# EAGLE schematic electrotactile_extension (EAGLE 9.4.0)
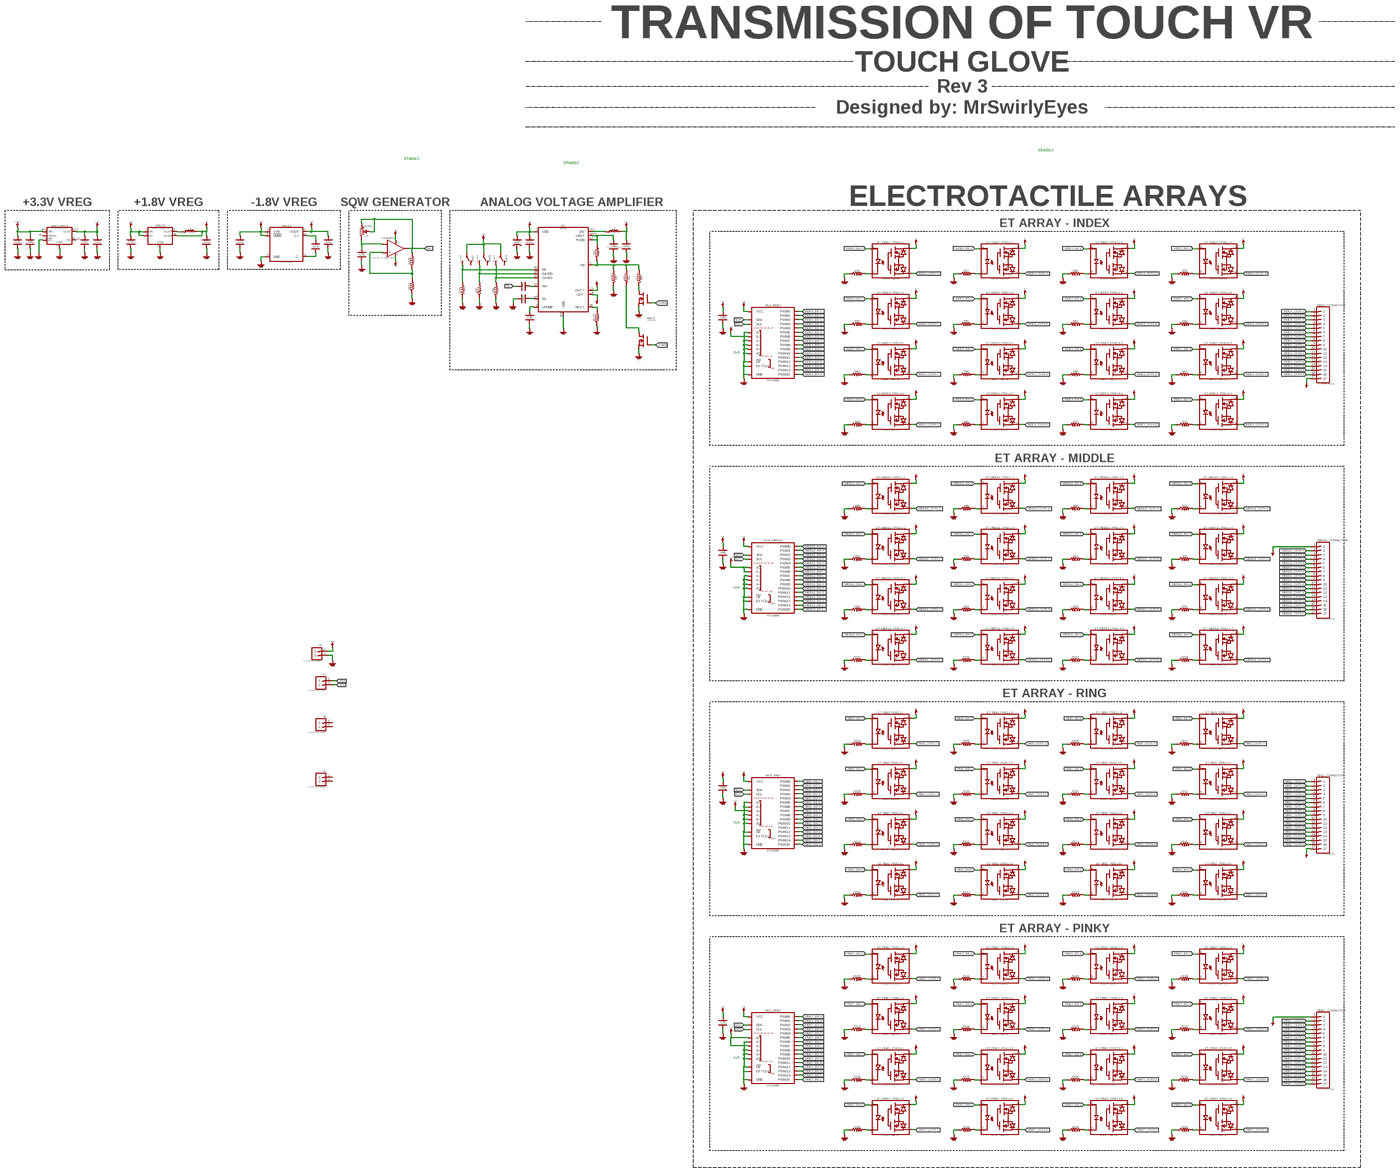
[diagram p0: schematic, sheet 1, overview]
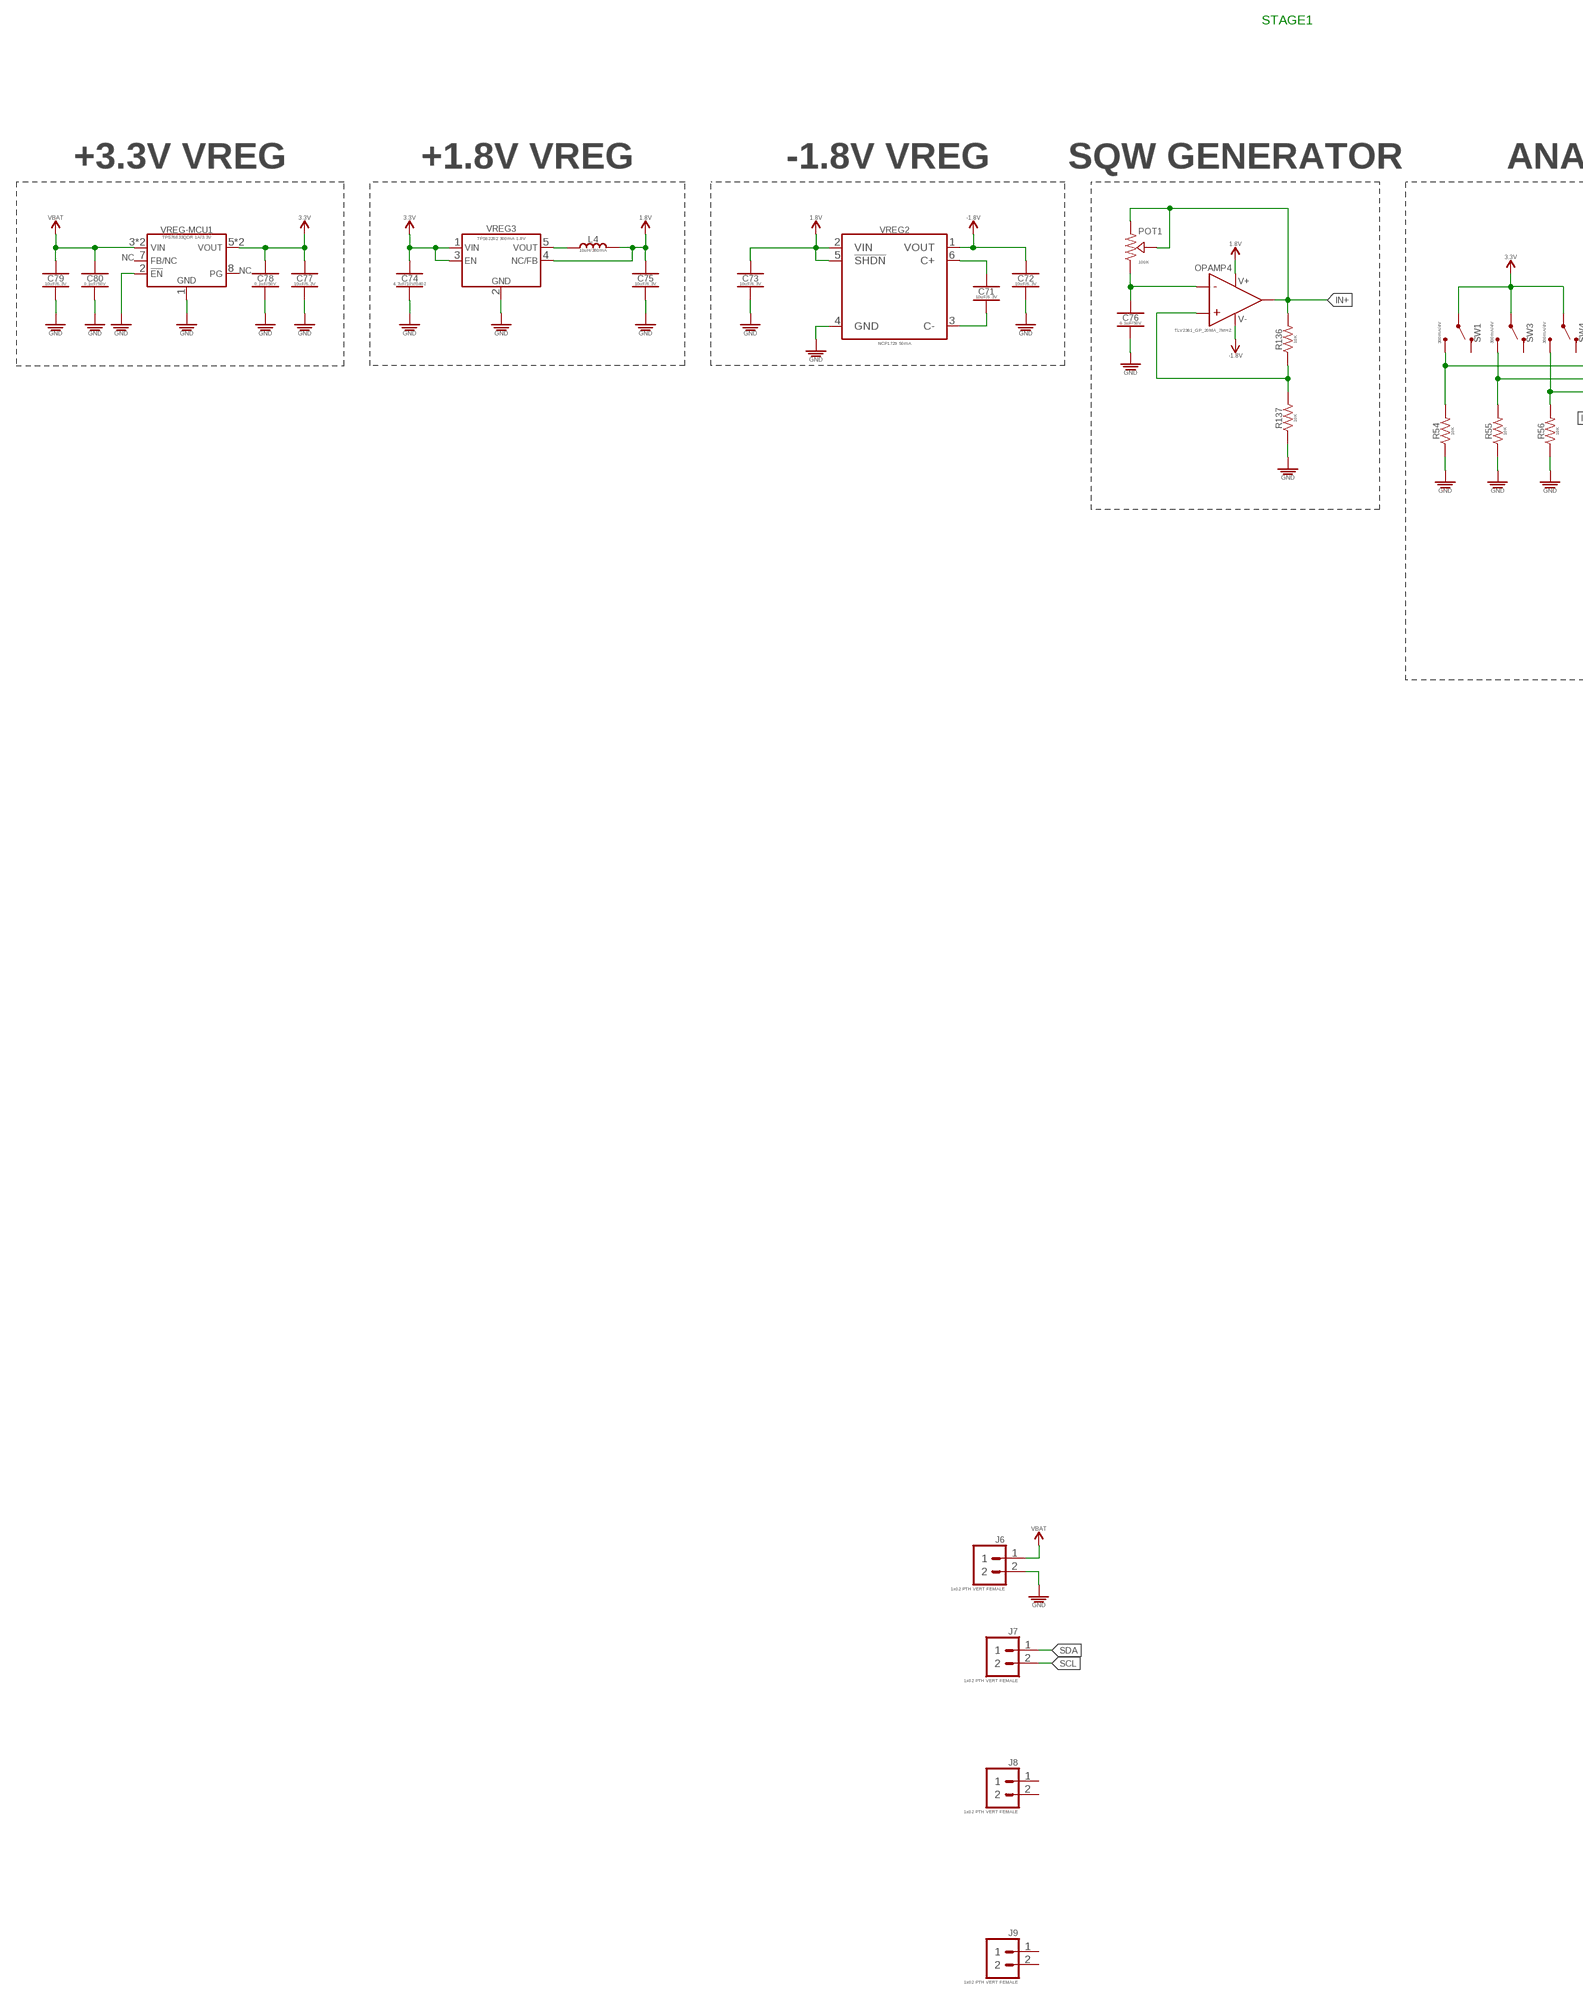
[diagram p1: schematic, sheet 1, part 1 of 5]
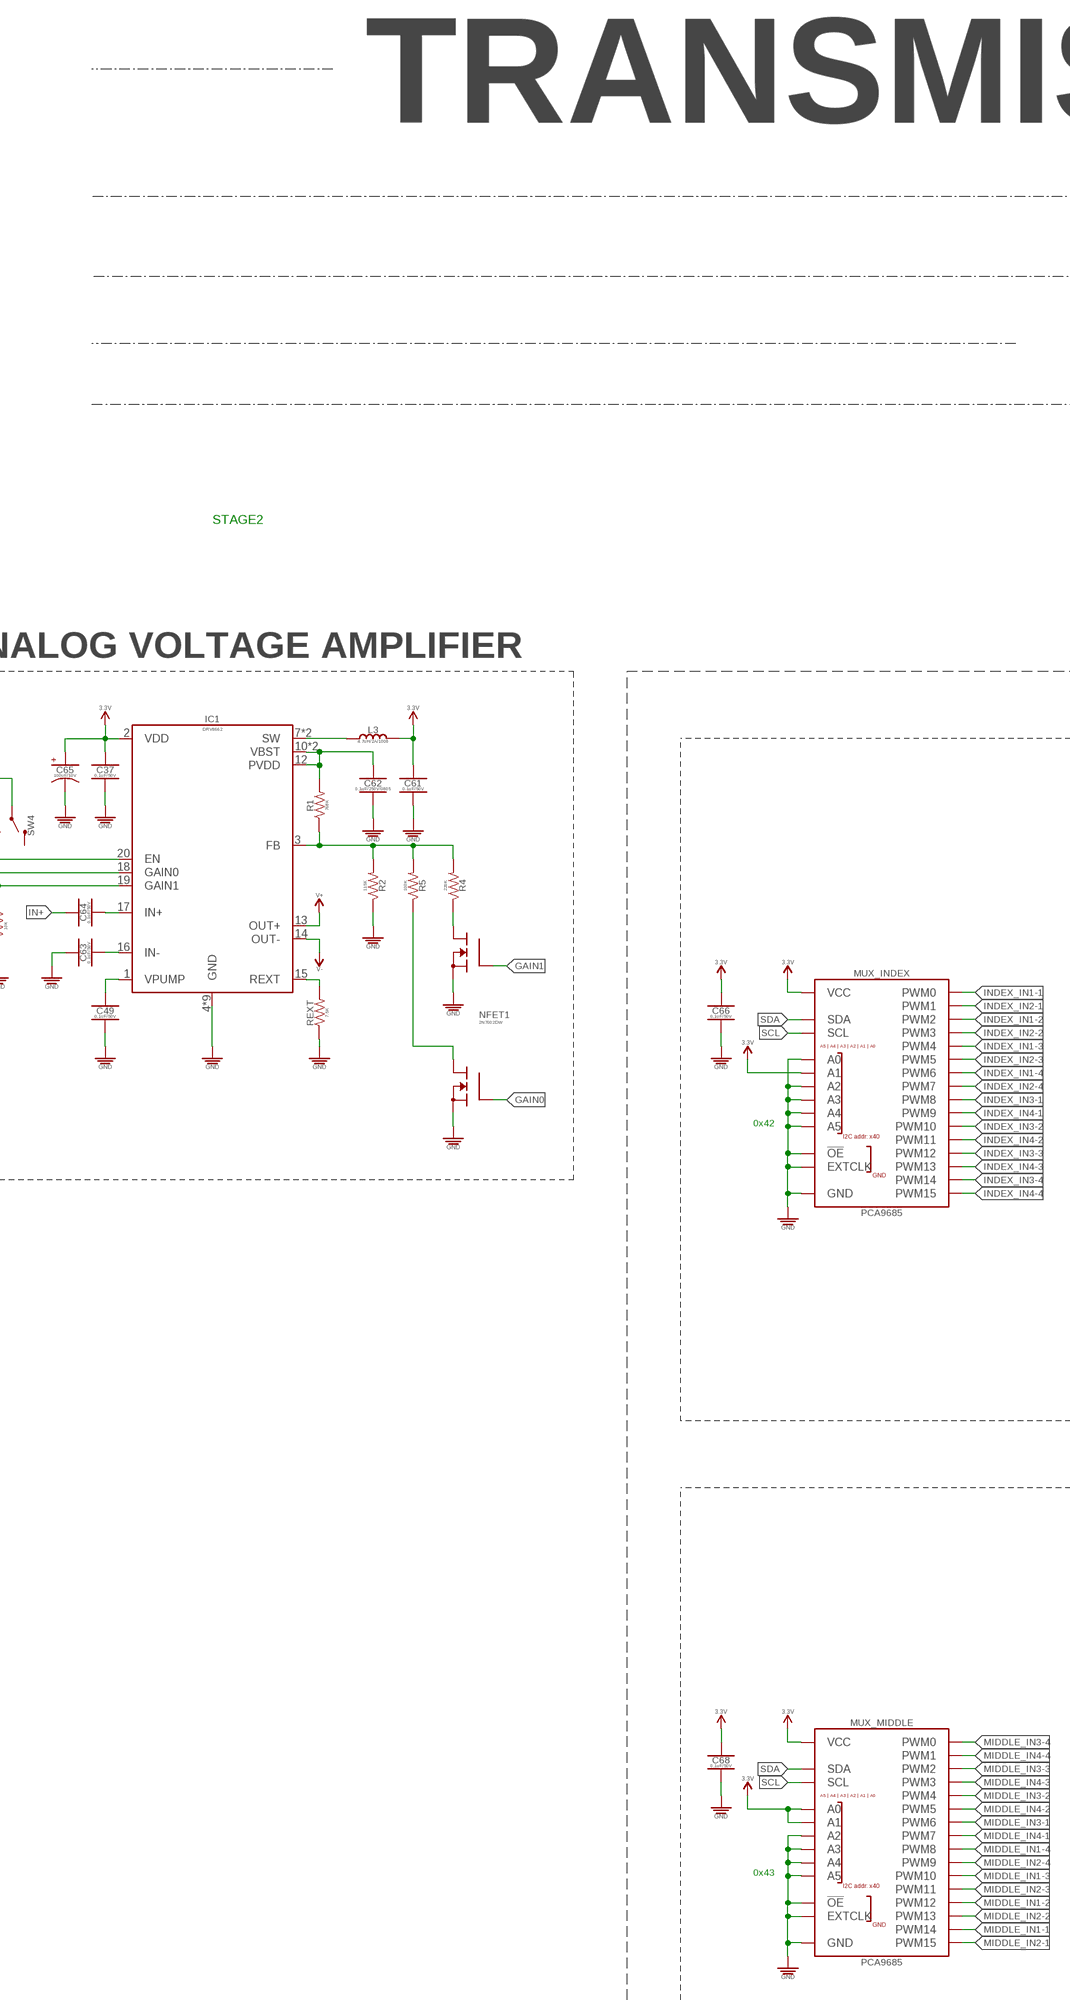
[diagram p2: schematic, sheet 1, part 2 of 5]
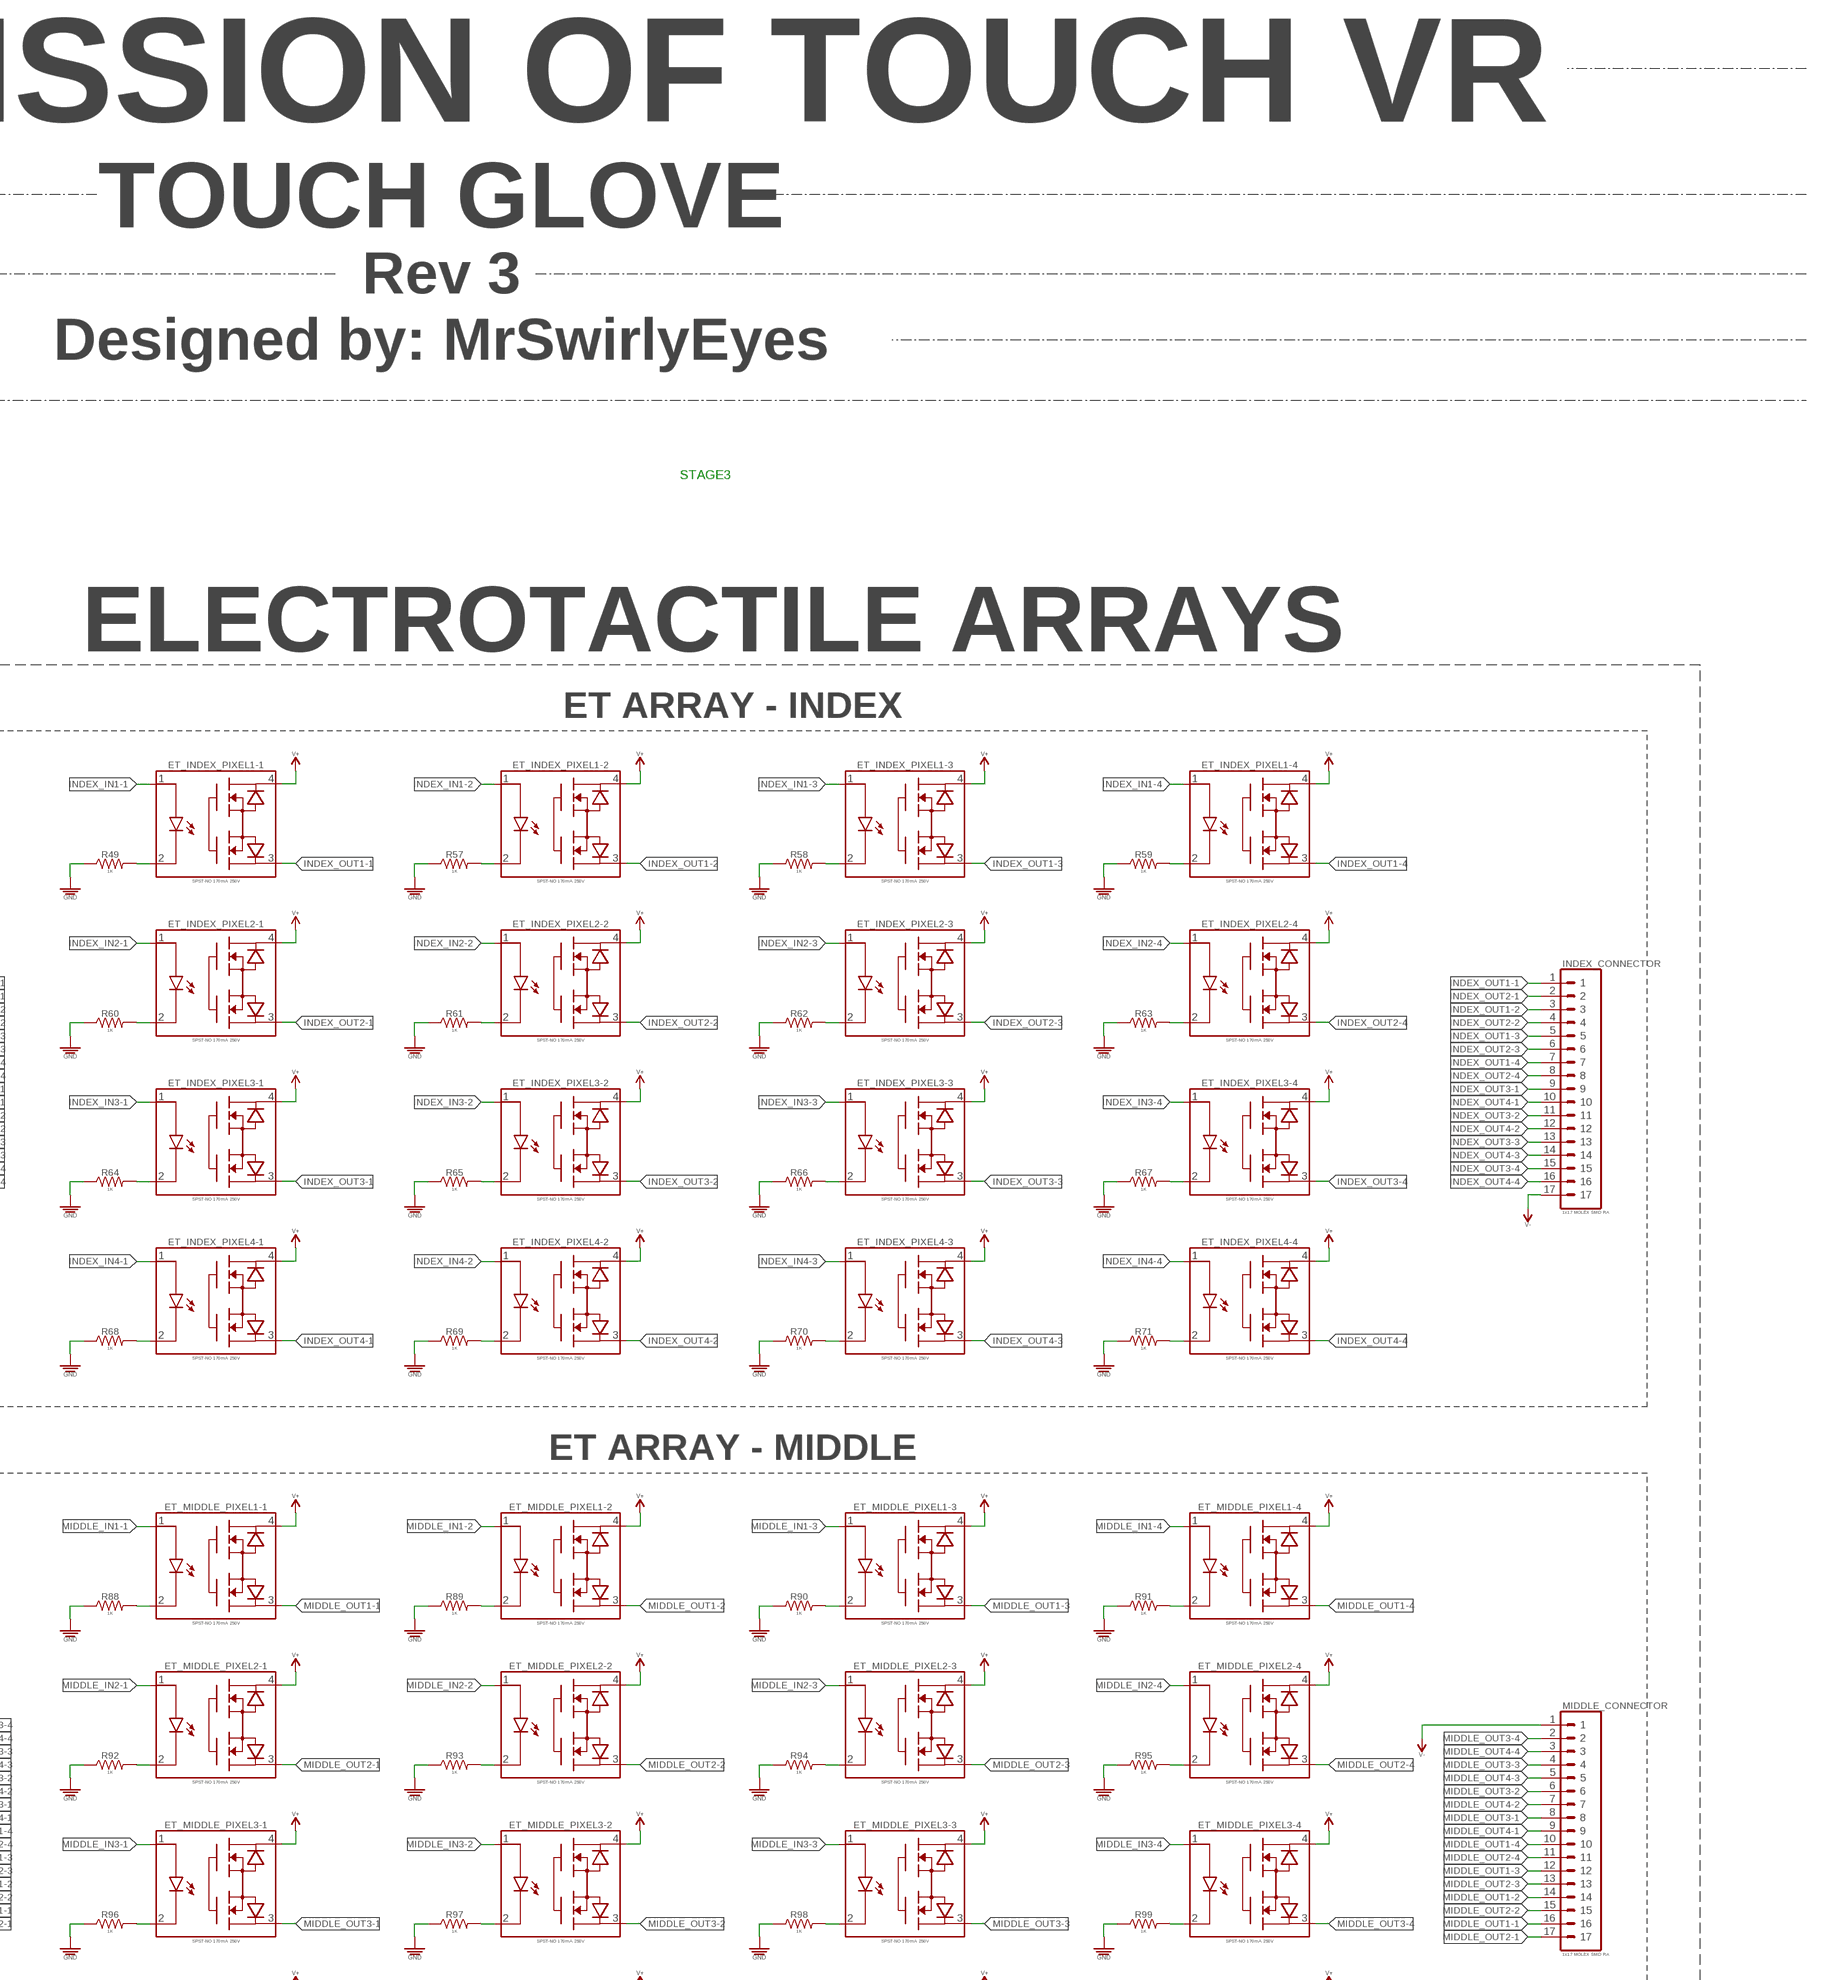
[diagram p3: schematic, sheet 1, part 3 of 5]
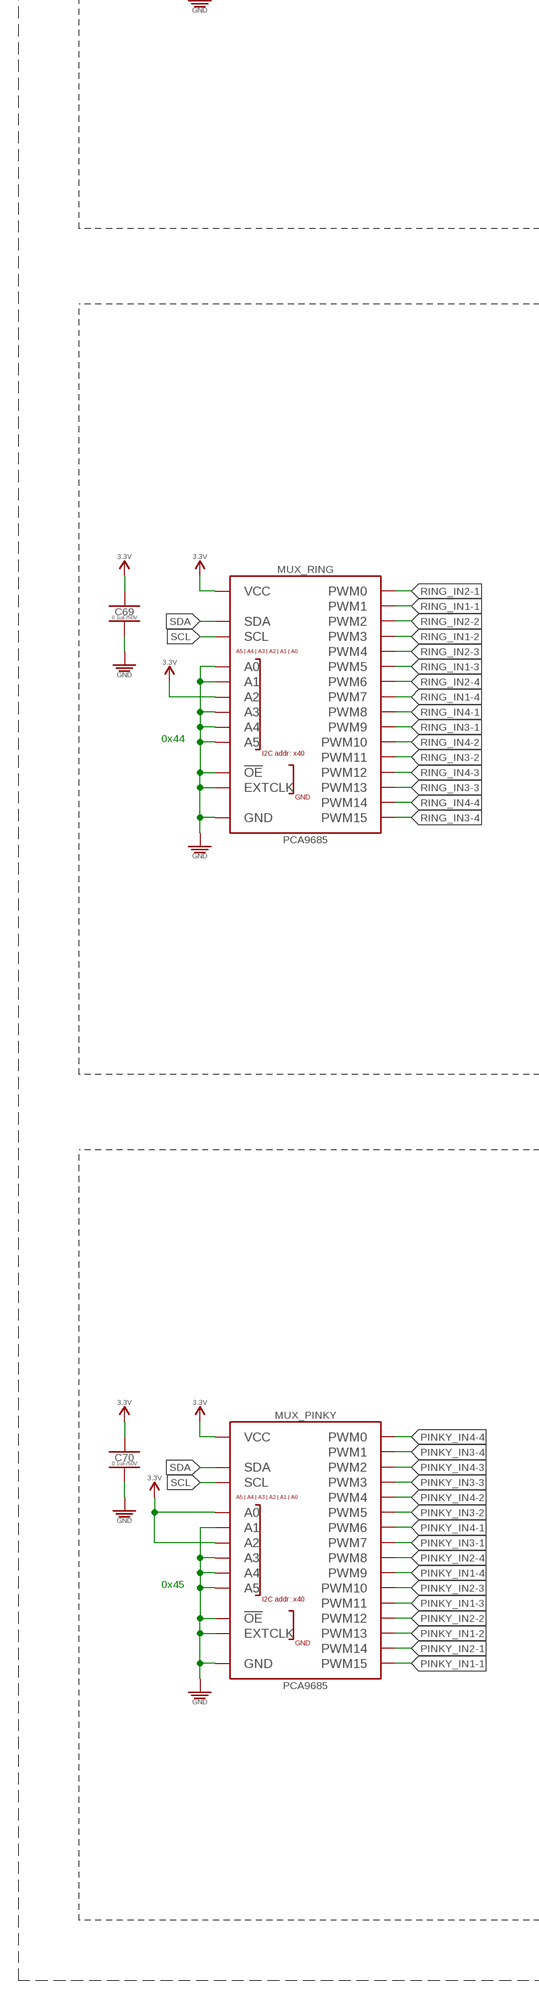
[diagram p4: schematic, sheet 1, part 4 of 5]
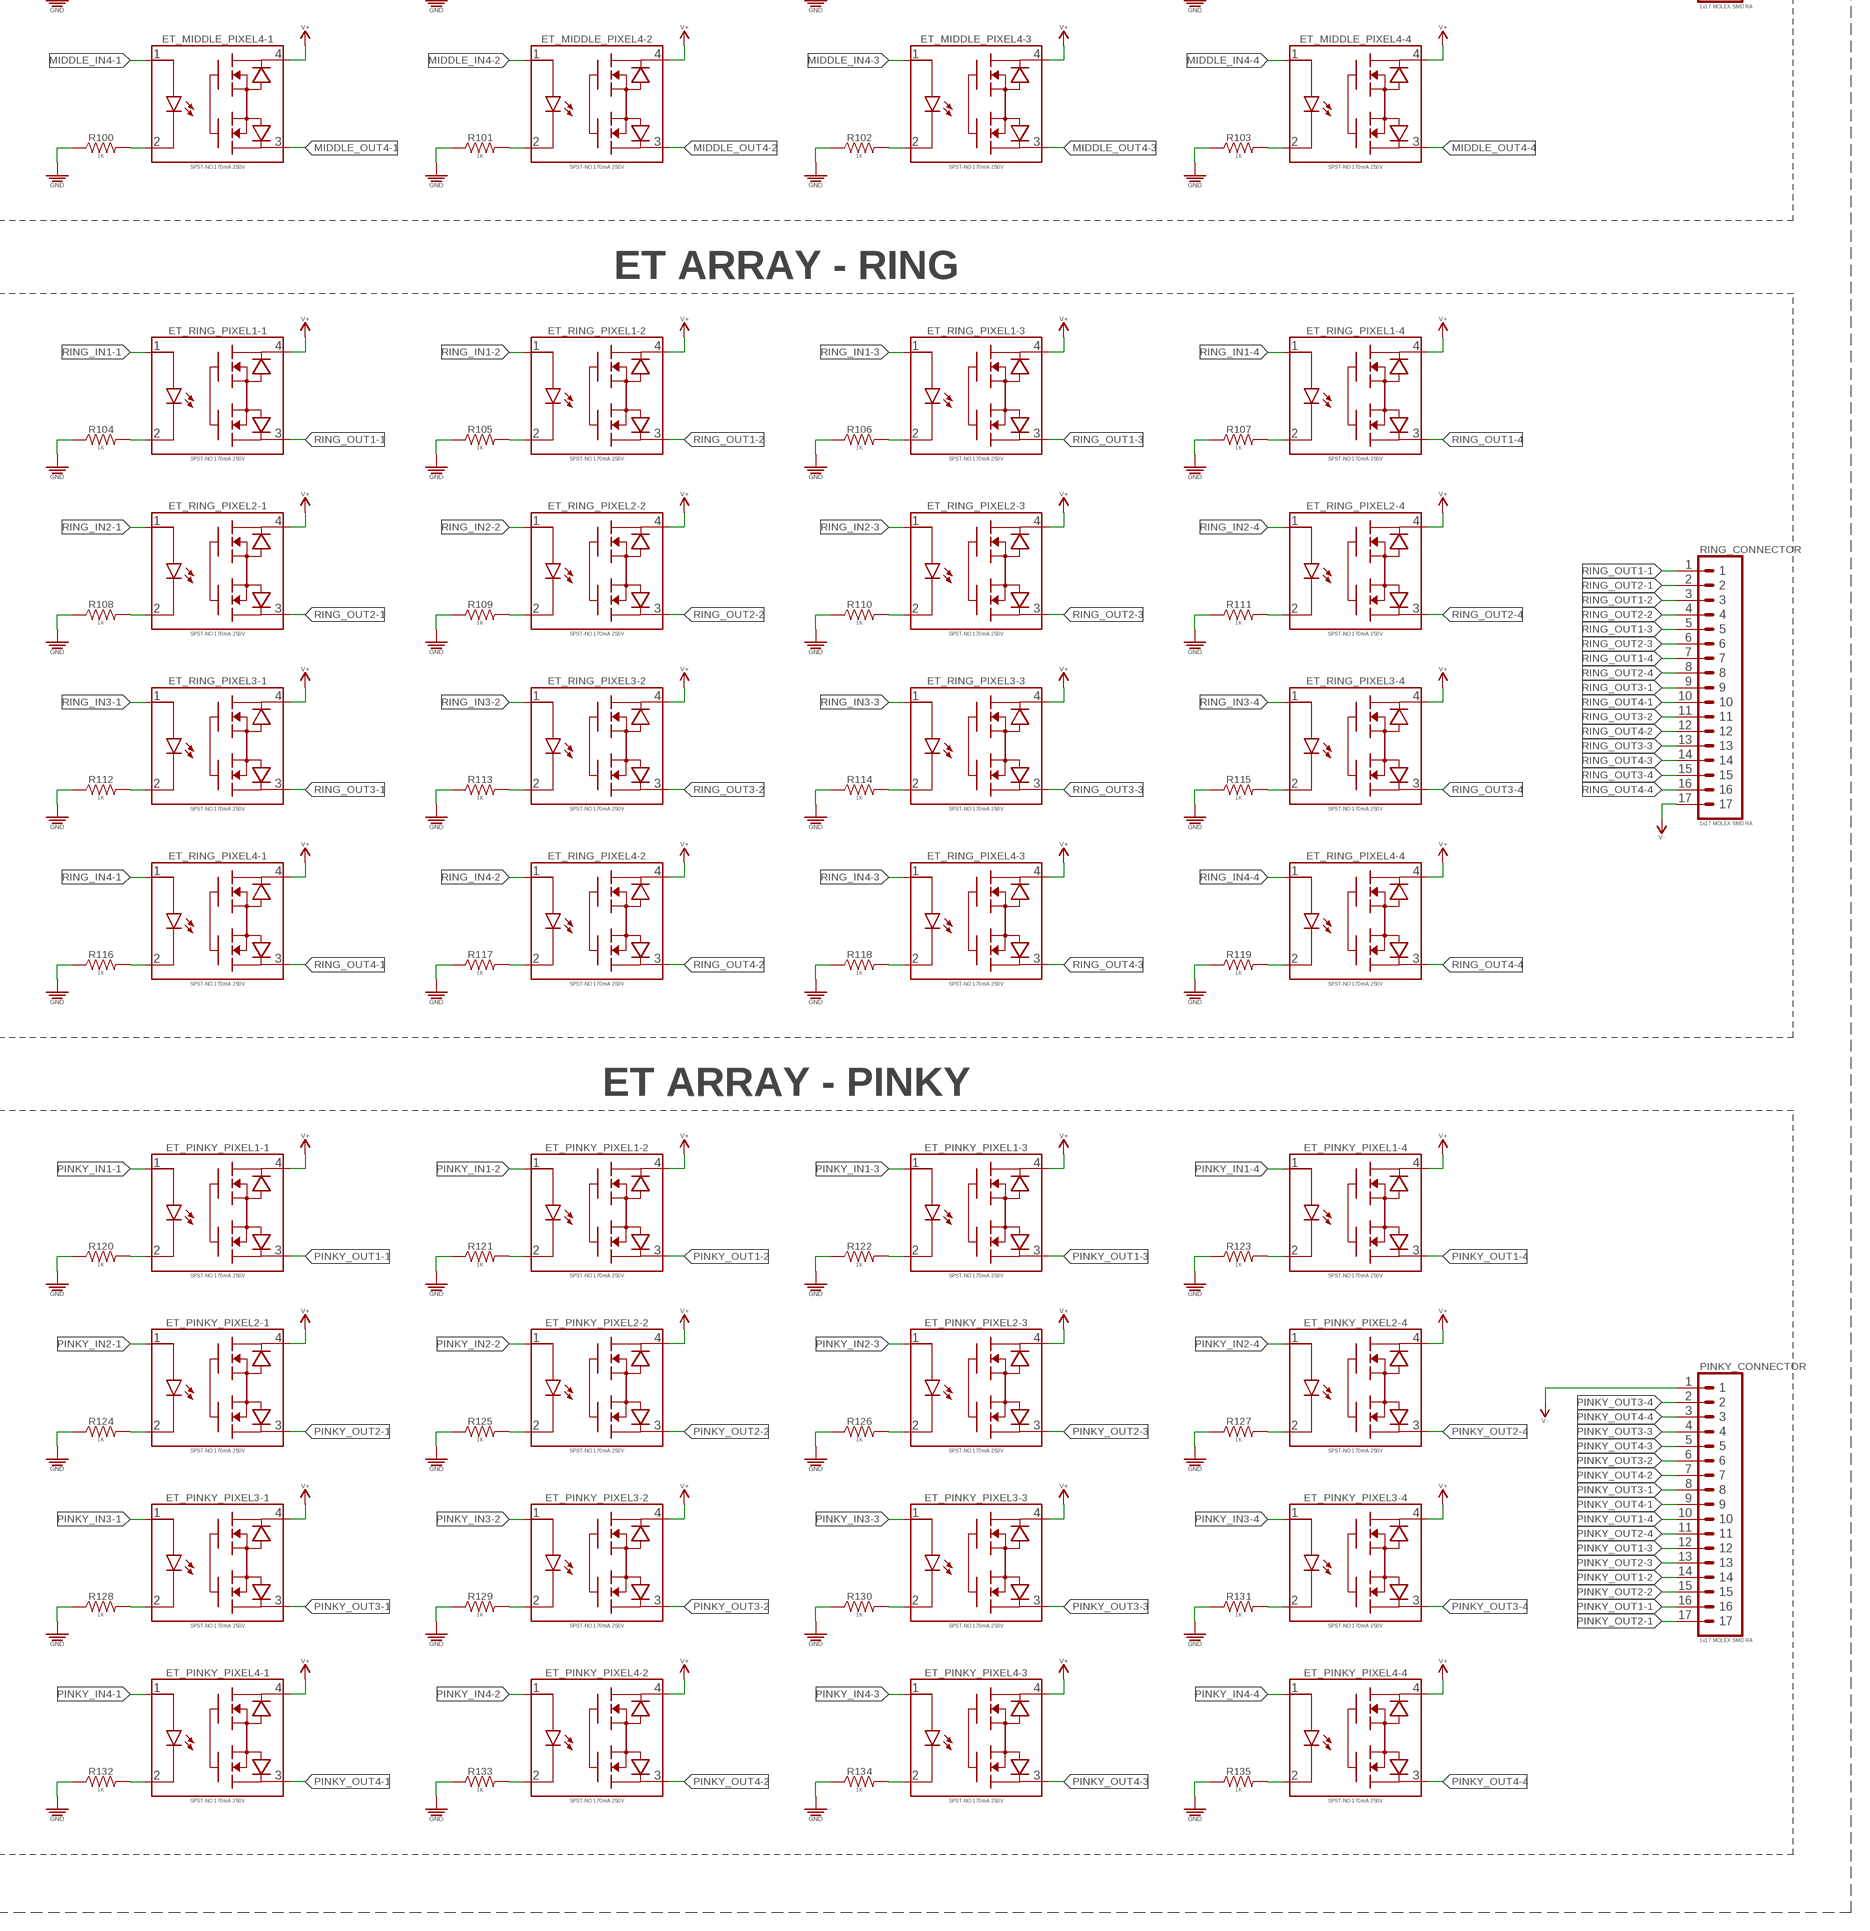
[diagram p5: schematic, sheet 1, part 5 of 5]

## Parts
C37  0.1uF/50V  0.1UF_SMD-0402_50V-10%  [CAPC1005X55_SMD-0402]
C49  0.1uF/50V  0.1UF_SMD-0402_50V-10%  [CAPC1005X55_SMD-0402]
C61  0.1uF/50V  0.1UF_SMD-0603_50V-20%  [CAPC1608X95]
C62  0.1uF/250V/0805  0.1UF_SMD-0805_250V-10%  [CAPC2012X95_SMD-0805]
C63  0.1uF/50V  0.1UF_SMD-0402_50V-10%  [CAPC1005X55_SMD-0402]
C64  0.1uF/50V  0.1UF_SMD-0402_50V-10%  [CAPC1005X55_SMD-0402]
C65  100uF/10V  100UF-POLARIZED_TANT_SMD-1206_10V-20%  [CAPCP3216X160]
C66  0.1uF/50V  0.1UF_SMD-0402_50V-10%  [CAPC1005X55_SMD-0402]
C68  0.1uF/50V  0.1UF_SMD-0402_50V-10%  [CAPC1005X55_SMD-0402]
C69  0.1uF/50V  0.1UF_SMD-0402_50V-10%  [CAPC1005X55_SMD-0402]
C70  0.1uF/50V  0.1UF_SMD-0402_50V-10%  [CAPC1005X55_SMD-0402]
C71  10uF/6.3V  10UF_CER_SMD-0402_6.3V-20%  [CAPC1005X55_SMD-0402]
C72  10uF/6.3V  10UF_CER_SMD-0402_6.3V-20%  [CAPC1005X55_SMD-0402]
C73  10uF/6.3V  10UF_CER_SMD-0402_6.3V-20%  [CAPC1005X55_SMD-0402]
C74  4.7uF/10V/0402  4.7UF_CER_SMD-0402_10V-20%  [CAPC1005X55_SMD-0402]
C75  10uF/6.3V  10UF_CER_SMD-0402_6.3V-20%  [CAPC1005X55_SMD-0402]
C76  0.1uF/50V  0.1UF_SMD-0402_50V-10%  [CAPC1005X55_SMD-0402]
C77  10uF/6.3V  10UF_CER_SMD-0402_6.3V-20%  [CAPC1005X55_SMD-0402]
C78  0.1uF/50V  0.1UF_SMD-0402_50V-10%  [CAPC1005X55_SMD-0402]
C79  10uF/6.3V  10UF_CER_SMD-0402_6.3V-20%  [CAPC1005X55_SMD-0402]
C80  0.1uF/50V  0.1UF_SMD-0402_50V-10%  [CAPC1005X55_SMD-0402]
ET_INDEX_PIXEL1-1  SPST-NO 170mA 250V  RELAY_SOLID-STATE_SSR_170MA_250V_SPST-NO  [SOP254P609X203-4]
ET_INDEX_PIXEL1-2  SPST-NO 170mA 250V  RELAY_SOLID-STATE_SSR_170MA_250V_SPST-NO  [SOP254P609X203-4]
ET_INDEX_PIXEL1-3  SPST-NO 170mA 250V  RELAY_SOLID-STATE_SSR_170MA_250V_SPST-NO  [SOP254P609X203-4]
ET_INDEX_PIXEL1-4  SPST-NO 170mA 250V  RELAY_SOLID-STATE_SSR_170MA_250V_SPST-NO  [SOP254P609X203-4]
ET_INDEX_PIXEL2-1  SPST-NO 170mA 250V  RELAY_SOLID-STATE_SSR_170MA_250V_SPST-NO  [SOP254P609X203-4]
ET_INDEX_PIXEL2-2  SPST-NO 170mA 250V  RELAY_SOLID-STATE_SSR_170MA_250V_SPST-NO  [SOP254P609X203-4]
ET_INDEX_PIXEL2-3  SPST-NO 170mA 250V  RELAY_SOLID-STATE_SSR_170MA_250V_SPST-NO  [SOP254P609X203-4]
ET_INDEX_PIXEL2-4  SPST-NO 170mA 250V  RELAY_SOLID-STATE_SSR_170MA_250V_SPST-NO  [SOP254P609X203-4]
ET_INDEX_PIXEL3-1  SPST-NO 170mA 250V  RELAY_SOLID-STATE_SSR_170MA_250V_SPST-NO  [SOP254P609X203-4]
ET_INDEX_PIXEL3-2  SPST-NO 170mA 250V  RELAY_SOLID-STATE_SSR_170MA_250V_SPST-NO  [SOP254P609X203-4]
ET_INDEX_PIXEL3-3  SPST-NO 170mA 250V  RELAY_SOLID-STATE_SSR_170MA_250V_SPST-NO  [SOP254P609X203-4]
ET_INDEX_PIXEL3-4  SPST-NO 170mA 250V  RELAY_SOLID-STATE_SSR_170MA_250V_SPST-NO  [SOP254P609X203-4]
ET_INDEX_PIXEL4-1  SPST-NO 170mA 250V  RELAY_SOLID-STATE_SSR_170MA_250V_SPST-NO  [SOP254P609X203-4]
ET_INDEX_PIXEL4-2  SPST-NO 170mA 250V  RELAY_SOLID-STATE_SSR_170MA_250V_SPST-NO  [SOP254P609X203-4]
ET_INDEX_PIXEL4-3  SPST-NO 170mA 250V  RELAY_SOLID-STATE_SSR_170MA_250V_SPST-NO  [SOP254P609X203-4]
ET_INDEX_PIXEL4-4  SPST-NO 170mA 250V  RELAY_SOLID-STATE_SSR_170MA_250V_SPST-NO  [SOP254P609X203-4]
ET_MIDDLE_PIXEL1-1  SPST-NO 170mA 250V  RELAY_SOLID-STATE_SSR_170MA_250V_SPST-NO  [SOP254P609X203-4]
ET_MIDDLE_PIXEL1-2  SPST-NO 170mA 250V  RELAY_SOLID-STATE_SSR_170MA_250V_SPST-NO  [SOP254P609X203-4]
ET_MIDDLE_PIXEL1-3  SPST-NO 170mA 250V  RELAY_SOLID-STATE_SSR_170MA_250V_SPST-NO  [SOP254P609X203-4]
ET_MIDDLE_PIXEL1-4  SPST-NO 170mA 250V  RELAY_SOLID-STATE_SSR_170MA_250V_SPST-NO  [SOP254P609X203-4]
ET_MIDDLE_PIXEL2-1  SPST-NO 170mA 250V  RELAY_SOLID-STATE_SSR_170MA_250V_SPST-NO  [SOP254P609X203-4]
ET_MIDDLE_PIXEL2-2  SPST-NO 170mA 250V  RELAY_SOLID-STATE_SSR_170MA_250V_SPST-NO  [SOP254P609X203-4]
ET_MIDDLE_PIXEL2-3  SPST-NO 170mA 250V  RELAY_SOLID-STATE_SSR_170MA_250V_SPST-NO  [SOP254P609X203-4]
ET_MIDDLE_PIXEL2-4  SPST-NO 170mA 250V  RELAY_SOLID-STATE_SSR_170MA_250V_SPST-NO  [SOP254P609X203-4]
ET_MIDDLE_PIXEL3-1  SPST-NO 170mA 250V  RELAY_SOLID-STATE_SSR_170MA_250V_SPST-NO  [SOP254P609X203-4]
ET_MIDDLE_PIXEL3-2  SPST-NO 170mA 250V  RELAY_SOLID-STATE_SSR_170MA_250V_SPST-NO  [SOP254P609X203-4]
ET_MIDDLE_PIXEL3-3  SPST-NO 170mA 250V  RELAY_SOLID-STATE_SSR_170MA_250V_SPST-NO  [SOP254P609X203-4]
ET_MIDDLE_PIXEL3-4  SPST-NO 170mA 250V  RELAY_SOLID-STATE_SSR_170MA_250V_SPST-NO  [SOP254P609X203-4]
ET_MIDDLE_PIXEL4-1  SPST-NO 170mA 250V  RELAY_SOLID-STATE_SSR_170MA_250V_SPST-NO  [SOP254P609X203-4]
ET_MIDDLE_PIXEL4-2  SPST-NO 170mA 250V  RELAY_SOLID-STATE_SSR_170MA_250V_SPST-NO  [SOP254P609X203-4]
ET_MIDDLE_PIXEL4-3  SPST-NO 170mA 250V  RELAY_SOLID-STATE_SSR_170MA_250V_SPST-NO  [SOP254P609X203-4]
ET_MIDDLE_PIXEL4-4  SPST-NO 170mA 250V  RELAY_SOLID-STATE_SSR_170MA_250V_SPST-NO  [SOP254P609X203-4]
ET_PINKY_PIXEL1-1  SPST-NO 170mA 250V  RELAY_SOLID-STATE_SSR_170MA_250V_SPST-NO  [SOP254P609X203-4]
ET_PINKY_PIXEL1-2  SPST-NO 170mA 250V  RELAY_SOLID-STATE_SSR_170MA_250V_SPST-NO  [SOP254P609X203-4]
ET_PINKY_PIXEL1-3  SPST-NO 170mA 250V  RELAY_SOLID-STATE_SSR_170MA_250V_SPST-NO  [SOP254P609X203-4]
ET_PINKY_PIXEL1-4  SPST-NO 170mA 250V  RELAY_SOLID-STATE_SSR_170MA_250V_SPST-NO  [SOP254P609X203-4]
ET_PINKY_PIXEL2-1  SPST-NO 170mA 250V  RELAY_SOLID-STATE_SSR_170MA_250V_SPST-NO  [SOP254P609X203-4]
ET_PINKY_PIXEL2-2  SPST-NO 170mA 250V  RELAY_SOLID-STATE_SSR_170MA_250V_SPST-NO  [SOP254P609X203-4]
ET_PINKY_PIXEL2-3  SPST-NO 170mA 250V  RELAY_SOLID-STATE_SSR_170MA_250V_SPST-NO  [SOP254P609X203-4]
ET_PINKY_PIXEL2-4  SPST-NO 170mA 250V  RELAY_SOLID-STATE_SSR_170MA_250V_SPST-NO  [SOP254P609X203-4]
ET_PINKY_PIXEL3-1  SPST-NO 170mA 250V  RELAY_SOLID-STATE_SSR_170MA_250V_SPST-NO  [SOP254P609X203-4]
ET_PINKY_PIXEL3-2  SPST-NO 170mA 250V  RELAY_SOLID-STATE_SSR_170MA_250V_SPST-NO  [SOP254P609X203-4]
ET_PINKY_PIXEL3-3  SPST-NO 170mA 250V  RELAY_SOLID-STATE_SSR_170MA_250V_SPST-NO  [SOP254P609X203-4]
ET_PINKY_PIXEL3-4  SPST-NO 170mA 250V  RELAY_SOLID-STATE_SSR_170MA_250V_SPST-NO  [SOP254P609X203-4]
ET_PINKY_PIXEL4-1  SPST-NO 170mA 250V  RELAY_SOLID-STATE_SSR_170MA_250V_SPST-NO  [SOP254P609X203-4]
ET_PINKY_PIXEL4-2  SPST-NO 170mA 250V  RELAY_SOLID-STATE_SSR_170MA_250V_SPST-NO  [SOP254P609X203-4]
ET_PINKY_PIXEL4-3  SPST-NO 170mA 250V  RELAY_SOLID-STATE_SSR_170MA_250V_SPST-NO  [SOP254P609X203-4]
ET_PINKY_PIXEL4-4  SPST-NO 170mA 250V  RELAY_SOLID-STATE_SSR_170MA_250V_SPST-NO  [SOP254P609X203-4]
ET_RING_PIXEL1-1  SPST-NO 170mA 250V  RELAY_SOLID-STATE_SSR_170MA_250V_SPST-NO  [SOP254P609X203-4]
ET_RING_PIXEL1-2  SPST-NO 170mA 250V  RELAY_SOLID-STATE_SSR_170MA_250V_SPST-NO  [SOP254P609X203-4]
ET_RING_PIXEL1-3  SPST-NO 170mA 250V  RELAY_SOLID-STATE_SSR_170MA_250V_SPST-NO  [SOP254P609X203-4]
ET_RING_PIXEL1-4  SPST-NO 170mA 250V  RELAY_SOLID-STATE_SSR_170MA_250V_SPST-NO  [SOP254P609X203-4]
ET_RING_PIXEL2-1  SPST-NO 170mA 250V  RELAY_SOLID-STATE_SSR_170MA_250V_SPST-NO  [SOP254P609X203-4]
ET_RING_PIXEL2-2  SPST-NO 170mA 250V  RELAY_SOLID-STATE_SSR_170MA_250V_SPST-NO  [SOP254P609X203-4]
ET_RING_PIXEL2-3  SPST-NO 170mA 250V  RELAY_SOLID-STATE_SSR_170MA_250V_SPST-NO  [SOP254P609X203-4]
ET_RING_PIXEL2-4  SPST-NO 170mA 250V  RELAY_SOLID-STATE_SSR_170MA_250V_SPST-NO  [SOP254P609X203-4]
ET_RING_PIXEL3-1  SPST-NO 170mA 250V  RELAY_SOLID-STATE_SSR_170MA_250V_SPST-NO  [SOP254P609X203-4]
ET_RING_PIXEL3-2  SPST-NO 170mA 250V  RELAY_SOLID-STATE_SSR_170MA_250V_SPST-NO  [SOP254P609X203-4]
ET_RING_PIXEL3-3  SPST-NO 170mA 250V  RELAY_SOLID-STATE_SSR_170MA_250V_SPST-NO  [SOP254P609X203-4]
ET_RING_PIXEL3-4  SPST-NO 170mA 250V  RELAY_SOLID-STATE_SSR_170MA_250V_SPST-NO  [SOP254P609X203-4]
ET_RING_PIXEL4-1  SPST-NO 170mA 250V  RELAY_SOLID-STATE_SSR_170MA_250V_SPST-NO  [SOP254P609X203-4]
ET_RING_PIXEL4-2  SPST-NO 170mA 250V  RELAY_SOLID-STATE_SSR_170MA_250V_SPST-NO  [SOP254P609X203-4]
ET_RING_PIXEL4-3  SPST-NO 170mA 250V  RELAY_SOLID-STATE_SSR_170MA_250V_SPST-NO  [SOP254P609X203-4]
ET_RING_PIXEL4-4  SPST-NO 170mA 250V  RELAY_SOLID-STATE_SSR_170MA_250V_SPST-NO  [SOP254P609X203-4]
IC1  DRV8662  DRV8662_PIEZO_HAPTICS_DRIVER_QFN-20-EP  [QFN50P400X400X100-21T270]
INDEX_CONNECTOR  1x17 MOLEX SMD RA  1X17_SMD_MOLEX  [1X17_MOLEX_0532611771_RA_SMD]
J6  1x02 PTH VERT FEMALE  1X02_PTH_VERT_FEMALE_2.54MM  [HDRVR2W64P254_1X2_558X254X850B]
J7  1x02 PTH VERT FEMALE  1X02_PTH_VERT_FEMALE_2.54MM  [HDRVR2W64P254_1X2_558X254X850B]
J8  1x02 PTH VERT FEMALE  1X02_PTH_VERT_FEMALE_2.54MM  [HDRVR2W64P254_1X2_558X254X850B]
J9  1x02 PTH VERT FEMALE  1X02_PTH_VERT_FEMALE_2.54MM  [HDRVR2W64P254_1X2_558X254X850B]
L3  4.7uH/2A/1008  4.7UH_SMD-1008_2A-0.200OHM-20%  [INDC2520X100]
L4  10uH/380mA  10UH_SMD-0603_0.38A-0.468OHM-10%  [INDC1608X60-0603]
MIDDLE_CONNECTOR  1x17 MOLEX SMD RA  1X17_SMD_MOLEX  [1X17_MOLEX_0532611771_RA_SMD]
MUX_INDEX  PCA9685  PCA9685_16-CH_12-BIT_PWM-DRIVER_TSSOP-28_PWM-DRIVER_16CH  [SOP65P650X110-28]
MUX_MIDDLE  PCA9685  PCA9685_16-CH_12-BIT_PWM-DRIVER_TSSOP-28_PWM-DRIVER_16CH  [SOP65P650X110-28]
MUX_PINKY  PCA9685  PCA9685_16-CH_12-BIT_PWM-DRIVER_TSSOP-28_PWM-DRIVER_16CH  [SOP65P650X110-28]
MUX_RING  PCA9685  PCA9685_16-CH_12-BIT_PWM-DRIVER_TSSOP-28_PWM-DRIVER_16CH  [SOP65P650X110-28]
NFET1  2N7002DW  MOSFET_N-CHANNEL_2-ARRAY_2N7002DW_115MA-60V  [SOT65P230X110-6]
OPAMP4  TLV2361_GP_20MA_7MHZ  [SOT95P280X145-5]
PINKY_CONNECTOR  1x17 MOLEX SMD RA  1X17_SMD_MOLEX  [1X17_MOLEX_0532611771_RA_SMD]
POT1  100K  POTENTIOMETER_ST4ETB104_100K-1/4W-20%  [POTENTIOMETER_SQ-L5-W4.5-H2.3]
R1  768K  768KΩ_SMD-0402_1/16W-1%  [RESC1005X35_SMD-0402]
R2  115K  35.7KΩ_SMD-0402_1/16W-1%  [RESC1005X35_SMD-0402]
R4  220K  20KΩ_SMD-0402_1/16W-1%  [RESC1005X35_SMD-0402]
R5  100K  41.2KΩ_SMD-0402_1/16W-1%  [RESC1005X35_SMD-0402]
R49  1K  1KΩ_SMD-0402_1/16W-5%  [RESC1005X35_SMD-0402]
R54  10K  10KΩ_SMD-0402_1/16W-5%  [RESC1005X35_SMD-0402]
R55  10K  10KΩ_SMD-0402_1/16W-5%  [RESC1005X35_SMD-0402]
R56  10K  10KΩ_SMD-0402_1/16W-5%  [RESC1005X35_SMD-0402]
R57  1K  1KΩ_SMD-0402_1/16W-5%  [RESC1005X35_SMD-0402]
R58  1K  1KΩ_SMD-0402_1/16W-5%  [RESC1005X35_SMD-0402]
R59  1K  1KΩ_SMD-0402_1/16W-5%  [RESC1005X35_SMD-0402]
R60  1K  1KΩ_SMD-0402_1/16W-5%  [RESC1005X35_SMD-0402]
R61  1K  1KΩ_SMD-0402_1/16W-5%  [RESC1005X35_SMD-0402]
R62  1K  1KΩ_SMD-0402_1/16W-5%  [RESC1005X35_SMD-0402]
R63  1K  1KΩ_SMD-0402_1/16W-5%  [RESC1005X35_SMD-0402]
R64  1K  1KΩ_SMD-0402_1/16W-5%  [RESC1005X35_SMD-0402]
R65  1K  1KΩ_SMD-0402_1/16W-5%  [RESC1005X35_SMD-0402]
R66  1K  1KΩ_SMD-0402_1/16W-5%  [RESC1005X35_SMD-0402]
R67  1K  1KΩ_SMD-0402_1/16W-5%  [RESC1005X35_SMD-0402]
R68  1K  1KΩ_SMD-0402_1/16W-5%  [RESC1005X35_SMD-0402]
R69  1K  1KΩ_SMD-0402_1/16W-5%  [RESC1005X35_SMD-0402]
R70  1K  1KΩ_SMD-0402_1/16W-5%  [RESC1005X35_SMD-0402]
R71  1K  1KΩ_SMD-0402_1/16W-5%  [RESC1005X35_SMD-0402]
R88  1K  1KΩ_SMD-0402_1/16W-5%  [RESC1005X35_SMD-0402]
R89  1K  1KΩ_SMD-0402_1/16W-5%  [RESC1005X35_SMD-0402]
R90  1K  1KΩ_SMD-0402_1/16W-5%  [RESC1005X35_SMD-0402]
R91  1K  1KΩ_SMD-0402_1/16W-5%  [RESC1005X35_SMD-0402]
R92  1K  1KΩ_SMD-0402_1/16W-5%  [RESC1005X35_SMD-0402]
R93  1K  1KΩ_SMD-0402_1/16W-5%  [RESC1005X35_SMD-0402]
R94  1K  1KΩ_SMD-0402_1/16W-5%  [RESC1005X35_SMD-0402]
R95  1K  1KΩ_SMD-0402_1/16W-5%  [RESC1005X35_SMD-0402]
R96  1K  1KΩ_SMD-0402_1/16W-5%  [RESC1005X35_SMD-0402]
R97  1K  1KΩ_SMD-0402_1/16W-5%  [RESC1005X35_SMD-0402]
R98  1K  1KΩ_SMD-0402_1/16W-5%  [RESC1005X35_SMD-0402]
R99  1K  1KΩ_SMD-0402_1/16W-5%  [RESC1005X35_SMD-0402]
R100  1K  1KΩ_SMD-0402_1/16W-5%  [RESC1005X35_SMD-0402]
R101  1K  1KΩ_SMD-0402_1/16W-5%  [RESC1005X35_SMD-0402]
R102  1K  1KΩ_SMD-0402_1/16W-5%  [RESC1005X35_SMD-0402]
R103  1K  1KΩ_SMD-0402_1/16W-5%  [RESC1005X35_SMD-0402]
R104  1K  1KΩ_SMD-0402_1/16W-5%  [RESC1005X35_SMD-0402]
R105  1K  1KΩ_SMD-0402_1/16W-5%  [RESC1005X35_SMD-0402]
R106  1K  1KΩ_SMD-0402_1/16W-5%  [RESC1005X35_SMD-0402]
R107  1K  1KΩ_SMD-0402_1/16W-5%  [RESC1005X35_SMD-0402]
R108  1K  1KΩ_SMD-0402_1/16W-5%  [RESC1005X35_SMD-0402]
R109  1K  1KΩ_SMD-0402_1/16W-5%  [RESC1005X35_SMD-0402]
R110  1K  1KΩ_SMD-0402_1/16W-5%  [RESC1005X35_SMD-0402]
R111  1K  1KΩ_SMD-0402_1/16W-5%  [RESC1005X35_SMD-0402]
R112  1K  1KΩ_SMD-0402_1/16W-5%  [RESC1005X35_SMD-0402]
R113  1K  1KΩ_SMD-0402_1/16W-5%  [RESC1005X35_SMD-0402]
R114  1K  1KΩ_SMD-0402_1/16W-5%  [RESC1005X35_SMD-0402]
R115  1K  1KΩ_SMD-0402_1/16W-5%  [RESC1005X35_SMD-0402]
R116  1K  1KΩ_SMD-0402_1/16W-5%  [RESC1005X35_SMD-0402]
R117  1K  1KΩ_SMD-0402_1/16W-5%  [RESC1005X35_SMD-0402]
R118  1K  1KΩ_SMD-0402_1/16W-5%  [RESC1005X35_SMD-0402]
R119  1K  1KΩ_SMD-0402_1/16W-5%  [RESC1005X35_SMD-0402]
R120  1K  1KΩ_SMD-0402_1/16W-5%  [RESC1005X35_SMD-0402]
R121  1K  1KΩ_SMD-0402_1/16W-5%  [RESC1005X35_SMD-0402]
R122  1K  1KΩ_SMD-0402_1/16W-5%  [RESC1005X35_SMD-0402]
R123  1K  1KΩ_SMD-0402_1/16W-5%  [RESC1005X35_SMD-0402]
R124  1K  1KΩ_SMD-0402_1/16W-5%  [RESC1005X35_SMD-0402]
R125  1K  1KΩ_SMD-0402_1/16W-5%  [RESC1005X35_SMD-0402]
R126  1K  1KΩ_SMD-0402_1/16W-5%  [RESC1005X35_SMD-0402]
R127  1K  1KΩ_SMD-0402_1/16W-5%  [RESC1005X35_SMD-0402]
R128  1K  1KΩ_SMD-0402_1/16W-5%  [RESC1005X35_SMD-0402]
R129  1K  1KΩ_SMD-0402_1/16W-5%  [RESC1005X35_SMD-0402]
R130  1K  1KΩ_SMD-0402_1/16W-5%  [RESC1005X35_SMD-0402]
R131  1K  1KΩ_SMD-0402_1/16W-5%  [RESC1005X35_SMD-0402]
R132  1K  1KΩ_SMD-0402_1/16W-5%  [RESC1005X35_SMD-0402]
R133  1K  1KΩ_SMD-0402_1/16W-5%  [RESC1005X35_SMD-0402]
R134  1K  1KΩ_SMD-0402_1/16W-5%  [RESC1005X35_SMD-0402]
R135  1K  1KΩ_SMD-0402_1/16W-5%  [RESC1005X35_SMD-0402]
R136  10K  10KΩ_SMD-0402_1/16W-5%  [RESC1005X35_SMD-0402]
R137  10K  10KΩ_SMD-0402_1/16W-5%  [RESC1005X35_SMD-0402]
REXT  7.5K  7.5KΩ_SMD-0402_1/16W-1%  [RESC1005X35_SMD-0402]
RING_CONNECTOR  1x17 MOLEX SMD RA  1X17_SMD_MOLEX  [1X17_MOLEX_0532611771_RA_SMD]
SW1  300mA/4V  SWITCH_SPDT_RA_SMD_300MA-4V_6.7L-2.6W  [SW_SLIDE_SPDT_RA_SMD_4V_300MA_6.7L-2.6W]
SW3  300mA/4V  SWITCH_SPDT_RA_SMD_300MA-4V_6.7L-2.6W  [SW_SLIDE_SPDT_RA_SMD_4V_300MA_6.7L-2.6W]
SW4  300mA/4V  SWITCH_SPDT_RA_SMD_300MA-4V_6.7L-2.6W  [SW_SLIDE_SPDT_RA_SMD_4V_300MA_6.7L-2.6W]
VREG2  NCP1729 50mA  VREG_NCP1729_NEGATIVE_SWITCHED-CAP-INVERTER_50MA  [SOT95P275X100-6]
VREG3  TPS62202 300mA 1.8V  VREG_SWITCHING_TPS6220XTPS62202_300MA_1.8V  [SOT95P280X145-5]
VREG-MCU1  TPS76833QDR 1A/3.3V  VREG_TPS768XX_ULDO_FAST-TRANSIENT_TPS76833QDR_1A-3.3V  [SOIC127P600X265-8]

## Nets
1.8V: C73.1 C75.1 L4.2 OPAMP4.5(V+) VREG2.2(VIN) VREG2.5(!SHDN) VREG3.4(NC/FB)
3.3V: C37.1 C61.1 C65.A C66.1 C68.1 C69.1 C70.1 C74.1 C77.1 C78.1 IC1.2(VDD) L3.2 MUX_INDEX.2(A1) MUX_INDEX.28(VCC) MUX_MIDDLE.1(A0) MUX_MIDDLE.2(A1) MUX_MIDDLE.28(VCC) MUX_PINKY.1(A0) MUX_PINKY.3(A2) MUX_PINKY.28(VCC) MUX_RING.3(A2) MUX_RING.28(VCC) SW1.2(P) SW3.2(P) SW4.2(P) VREG3.1(VIN) VREG3.3(EN) VREG-MCU1.5(VOUT) VREG-MCU1.6(VOUT)
-1.8V: C72.1 OPAMP4.2(V-) VREG2.1(VOUT)
C+: C71.1 VREG2.6(C+)
C-: C71.2 VREG2.3(C-)
EN: IC1.20(EN) R54.2 SW1.3(S2)
FB: IC1.3(FB) R1.1 R2.2 R4.2 R5.2
GAIN0: IC1.18(GAIN0) NFET1.5(G2) R55.2 SW3.3(S2)
GAIN1: IC1.19(GAIN1) NFET1.2(G1) R56.2 SW4.3(S2)
GND [DGND]: C37.2 C49.2 C61.2 C62.2 C63.1 C65.K C66.2 C68.2 C69.2 C70.2 C72.2 C73.2 C74.2 C75.2 C76.2 C77.2 C78.2 C79.2 C80.2 IC1.4(GND) IC1.5(GND) IC1.6(GND) IC1.9(GND) IC1.EP(GND) IC1.P$1(GND) IC1.P$2(GND) IC1.P$3(GND) IC1.P$4(GND) J6.2 MUX_INDEX.1(A0) MUX_INDEX.3(A2) MUX_INDEX.4(A3) MUX_INDEX.5(A4) MUX_INDEX.14(GND) MUX_INDEX.23(!OE) MUX_INDEX.24(A5) MUX_INDEX.25(EXTCLK) MUX_MIDDLE.3(A2) MUX_MIDDLE.4(A3) MUX_MIDDLE.5(A4) MUX_MIDDLE.14(GND) MUX_MIDDLE.23(!OE) MUX_MIDDLE.24(A5) MUX_MIDDLE.25(EXTCLK) MUX_PINKY.2(A1) MUX_PINKY.4(A3) MUX_PINKY.5(A4) MUX_PINKY.14(GND) MUX_PINKY.23(!OE) MUX_PINKY.24(A5) MUX_PINKY.25(EXTCLK) MUX_RING.1(A0) MUX_RING.2(A1) MUX_RING.4(A3) MUX_RING.5(A4) MUX_RING.14(GND) MUX_RING.23(!OE) MUX_RING.24(A5) MUX_RING.25(EXTCLK) NFET1.1(S1) NFET1.4(S2) R2.1 R49.1 R54.1 R55.1 R56.1 R57.1 R58.1 R59.1 R60.1 R61.1 R62.1 R63.1 R64.1 R65.1 R66.1 R67.1 R68.1 R69.1 R70.1 R71.1 R88.1 R89.1 R90.1 R91.1 R92.1 R93.1 R94.1 R95.1 R96.1 R97.1 R98.1 R99.1 R100.1 R101.1 R102.1 R103.1 R104.1 R105.1 R106.1 R107.1 R108.1 R109.1 R110.1 R111.1 R112.1 R113.1 R114.1 R115.1 R116.1 R117.1 R118.1 R119.1 R120.1 R121.1 R122.1 R123.1 R124.1 R125.1 R126.1 R127.1 R128.1 R129.1 R130.1 R131.1 R132.1 R133.1 R134.1 R135.1 R137.1 REXT.1 VREG2.4(GND) VREG3.2(GND) VREG-MCU1.1(GND) VREG-MCU1.2(!EN)
IN+: C64.1 OPAMP4.4(OUT) POT1.1(CCW) POT1.2(S) R136.2
INDEX_IN1-1: ET_INDEX_PIXEL1-1.1 MUX_INDEX.6(PWM0)
INDEX_IN1-2: ET_INDEX_PIXEL1-2.1 MUX_INDEX.8(PWM2)
INDEX_IN1-3: ET_INDEX_PIXEL1-3.1 MUX_INDEX.10(PWM4)
INDEX_IN1-4: ET_INDEX_PIXEL1-4.1 MUX_INDEX.12(PWM6)
INDEX_IN2-1: ET_INDEX_PIXEL2-1.1 MUX_INDEX.7(PWM1)
INDEX_IN2-2: ET_INDEX_PIXEL2-2.1 MUX_INDEX.9(PWM3)
INDEX_IN2-3: ET_INDEX_PIXEL2-3.1 MUX_INDEX.11(PWM5)
INDEX_IN2-4: ET_INDEX_PIXEL2-4.1 MUX_INDEX.13(PWM7)
INDEX_IN3-1: ET_INDEX_PIXEL3-1.1 MUX_INDEX.15(PWM8)
INDEX_IN3-2: ET_INDEX_PIXEL3-2.1 MUX_INDEX.17(PWM10)
INDEX_IN3-3: ET_INDEX_PIXEL3-3.1 MUX_INDEX.19(PWM12)
INDEX_IN3-4: ET_INDEX_PIXEL3-4.1 MUX_INDEX.21(PWM14)
INDEX_IN4-1: ET_INDEX_PIXEL4-1.1 MUX_INDEX.16(PWM9)
INDEX_IN4-2: ET_INDEX_PIXEL4-2.1 MUX_INDEX.18(PWM11)
INDEX_IN4-3: ET_INDEX_PIXEL4-3.1 MUX_INDEX.20(PWM13)
INDEX_IN4-4: ET_INDEX_PIXEL4-4.1 MUX_INDEX.22(PWM15)
INDEX_OUT1-1 [DGND]: ET_INDEX_PIXEL1-1.3 INDEX_CONNECTOR.1
INDEX_OUT1-2 [DGND]: ET_INDEX_PIXEL1-2.3 INDEX_CONNECTOR.3
INDEX_OUT1-3 [DGND]: ET_INDEX_PIXEL1-3.3 INDEX_CONNECTOR.5
INDEX_OUT1-4 [DGND]: ET_INDEX_PIXEL1-4.3 INDEX_CONNECTOR.7
INDEX_OUT2-1 [DGND]: ET_INDEX_PIXEL2-1.3 INDEX_CONNECTOR.2
INDEX_OUT2-2 [DGND]: ET_INDEX_PIXEL2-2.3 INDEX_CONNECTOR.4
INDEX_OUT2-3 [DGND]: ET_INDEX_PIXEL2-3.3 INDEX_CONNECTOR.6
INDEX_OUT2-4 [DGND]: ET_INDEX_PIXEL2-4.3 INDEX_CONNECTOR.8
INDEX_OUT3-1 [DGND]: ET_INDEX_PIXEL3-1.3 INDEX_CONNECTOR.9
INDEX_OUT3-2 [DGND]: ET_INDEX_PIXEL3-2.3 INDEX_CONNECTOR.11
INDEX_OUT3-3 [DGND]: ET_INDEX_PIXEL3-3.3 INDEX_CONNECTOR.13
INDEX_OUT3-4 [DGND]: ET_INDEX_PIXEL3-4.3 INDEX_CONNECTOR.15
INDEX_OUT4-1 [DGND]: ET_INDEX_PIXEL4-1.3 INDEX_CONNECTOR.10
INDEX_OUT4-2 [DGND]: ET_INDEX_PIXEL4-2.3 INDEX_CONNECTOR.12
INDEX_OUT4-3 [DGND]: ET_INDEX_PIXEL4-3.3 INDEX_CONNECTOR.14
INDEX_OUT4-4 [DGND]: ET_INDEX_PIXEL4-4.3 INDEX_CONNECTOR.16
MIDDLE_IN1-1: ET_MIDDLE_PIXEL1-1.1 MUX_MIDDLE.21(PWM14)
MIDDLE_IN1-2: ET_MIDDLE_PIXEL1-2.1 MUX_MIDDLE.19(PWM12)
MIDDLE_IN1-3: ET_MIDDLE_PIXEL1-3.1 MUX_MIDDLE.17(PWM10)
MIDDLE_IN1-4: ET_MIDDLE_PIXEL1-4.1 MUX_MIDDLE.15(PWM8)
MIDDLE_IN2-1: ET_MIDDLE_PIXEL2-1.1 MUX_MIDDLE.22(PWM15)
MIDDLE_IN2-2: ET_MIDDLE_PIXEL2-2.1 MUX_MIDDLE.20(PWM13)
MIDDLE_IN2-3: ET_MIDDLE_PIXEL2-3.1 MUX_MIDDLE.18(PWM11)
MIDDLE_IN2-4: ET_MIDDLE_PIXEL2-4.1 MUX_MIDDLE.16(PWM9)
MIDDLE_IN3-1: ET_MIDDLE_PIXEL3-1.1 MUX_MIDDLE.12(PWM6)
MIDDLE_IN3-2: ET_MIDDLE_PIXEL3-2.1 MUX_MIDDLE.10(PWM4)
MIDDLE_IN3-3: ET_MIDDLE_PIXEL3-3.1 MUX_MIDDLE.8(PWM2)
MIDDLE_IN3-4: ET_MIDDLE_PIXEL3-4.1 MUX_MIDDLE.6(PWM0)
MIDDLE_IN4-1: ET_MIDDLE_PIXEL4-1.1 MUX_MIDDLE.13(PWM7)
MIDDLE_IN4-2: ET_MIDDLE_PIXEL4-2.1 MUX_MIDDLE.11(PWM5)
MIDDLE_IN4-3: ET_MIDDLE_PIXEL4-3.1 MUX_MIDDLE.9(PWM3)
MIDDLE_IN4-4: ET_MIDDLE_PIXEL4-4.1 MUX_MIDDLE.7(PWM1)
MIDDLE_OUT1-1 [DGND]: ET_MIDDLE_PIXEL1-1.3 MIDDLE_CONNECTOR.16
MIDDLE_OUT1-2 [DGND]: ET_MIDDLE_PIXEL1-2.3 MIDDLE_CONNECTOR.14
MIDDLE_OUT1-3 [DGND]: ET_MIDDLE_PIXEL1-3.3 MIDDLE_CONNECTOR.12
MIDDLE_OUT1-4 [DGND]: ET_MIDDLE_PIXEL1-4.3 MIDDLE_CONNECTOR.10
MIDDLE_OUT2-1 [DGND]: ET_MIDDLE_PIXEL2-1.3 MIDDLE_CONNECTOR.17
MIDDLE_OUT2-2 [DGND]: ET_MIDDLE_PIXEL2-2.3 MIDDLE_CONNECTOR.15
MIDDLE_OUT2-3 [DGND]: ET_MIDDLE_PIXEL2-3.3 MIDDLE_CONNECTOR.13
MIDDLE_OUT2-4 [DGND]: ET_MIDDLE_PIXEL2-4.3 MIDDLE_CONNECTOR.11
MIDDLE_OUT3-1 [DGND]: ET_MIDDLE_PIXEL3-1.3 MIDDLE_CONNECTOR.8
MIDDLE_OUT3-2 [DGND]: ET_MIDDLE_PIXEL3-2.3 MIDDLE_CONNECTOR.6
MIDDLE_OUT3-3 [DGND]: ET_MIDDLE_PIXEL3-3.3 MIDDLE_CONNECTOR.4
MIDDLE_OUT3-4 [DGND]: ET_MIDDLE_PIXEL3-4.3 MIDDLE_CONNECTOR.2
MIDDLE_OUT4-1 [DGND]: ET_MIDDLE_PIXEL4-1.3 MIDDLE_CONNECTOR.9
MIDDLE_OUT4-2 [DGND]: ET_MIDDLE_PIXEL4-2.3 MIDDLE_CONNECTOR.7
MIDDLE_OUT4-3 [DGND]: ET_MIDDLE_PIXEL4-3.3 MIDDLE_CONNECTOR.5
MIDDLE_OUT4-4 [DGND]: ET_MIDDLE_PIXEL4-4.3 MIDDLE_CONNECTOR.3
N$33: ET_INDEX_PIXEL1-3.2 R58.2
N$39: ET_INDEX_PIXEL1-1.2 R49.2
N$42: IC1.7(SW) IC1.8(SW) L3.1
N$43: C49.1 IC1.1(VPUMP)
N$44: C62.1 IC1.10(VBST) IC1.11(VBST) IC1.12(PVDD) R1.2
N$48: IC1.15(REXT) REXT.2
N$49: NFET1.6(D1) R4.1
N$51: NFET1.3(D2) R5.1
N$52: C64.2 IC1.17(IN+)
N$56: C63.2 IC1.16(IN-)
N$57: ET_INDEX_PIXEL1-2.2 R57.2
N$59: ET_INDEX_PIXEL1-4.2 R59.2
N$60: ET_INDEX_PIXEL2-1.2 R60.2
N$61: ET_INDEX_PIXEL2-2.2 R61.2
N$64: ET_INDEX_PIXEL2-3.2 R62.2
N$65: ET_INDEX_PIXEL2-4.2 R63.2
N$66: ET_INDEX_PIXEL3-1.2 R64.2
N$67: ET_INDEX_PIXEL3-2.2 R65.2
N$68: ET_INDEX_PIXEL3-3.2 R66.2
N$69: ET_INDEX_PIXEL3-4.2 R67.2
N$70: ET_INDEX_PIXEL4-1.2 R68.2
N$71: ET_INDEX_PIXEL4-2.2 R69.2
N$72: ET_INDEX_PIXEL4-3.2 R70.2
N$73: ET_INDEX_PIXEL4-4.2 R71.2
N$89: ET_MIDDLE_PIXEL1-1.2 R88.2
N$90: ET_MIDDLE_PIXEL1-2.2 R89.2
N$91: ET_MIDDLE_PIXEL1-3.2 R90.2
N$92: ET_MIDDLE_PIXEL1-4.2 R91.2
N$93: ET_MIDDLE_PIXEL2-1.2 R92.2
N$94: ET_MIDDLE_PIXEL2-2.2 R93.2
N$95: ET_MIDDLE_PIXEL2-3.2 R94.2
N$96: ET_MIDDLE_PIXEL2-4.2 R95.2
N$97: ET_MIDDLE_PIXEL3-1.2 R96.2
N$98: ET_MIDDLE_PIXEL3-2.2 R97.2
N$99: ET_MIDDLE_PIXEL3-3.2 R98.2
N$100: ET_MIDDLE_PIXEL3-4.2 R99.2
N$101: ET_MIDDLE_PIXEL4-1.2 R100.2
N$102: ET_MIDDLE_PIXEL4-2.2 R101.2
N$103: ET_MIDDLE_PIXEL4-3.2 R102.2
N$104: ET_MIDDLE_PIXEL4-4.2 R103.2
N$105: ET_RING_PIXEL1-1.2 R104.2
N$106: ET_RING_PIXEL1-2.2 R105.2
N$107: ET_RING_PIXEL1-3.2 R106.2
N$108: ET_RING_PIXEL1-4.2 R107.2
N$109: ET_RING_PIXEL2-1.2 R108.2
N$110: ET_RING_PIXEL2-2.2 R109.2
N$111: ET_RING_PIXEL2-3.2 R110.2
N$112: ET_RING_PIXEL2-4.2 R111.2
N$113: ET_RING_PIXEL3-1.2 R112.2
N$114: ET_RING_PIXEL3-2.2 R113.2
N$115: ET_RING_PIXEL3-3.2 R114.2
N$116: ET_RING_PIXEL3-4.2 R115.2
N$117: ET_RING_PIXEL4-1.2 R116.2
N$118: ET_RING_PIXEL4-2.2 R117.2
N$119: ET_RING_PIXEL4-3.2 R118.2
N$120: ET_RING_PIXEL4-4.2 R119.2
N$121: ET_PINKY_PIXEL1-1.2 R120.2
N$122: ET_PINKY_PIXEL1-2.2 R121.2
N$123: ET_PINKY_PIXEL1-3.2 R122.2
N$124: ET_PINKY_PIXEL1-4.2 R123.2
N$125: ET_PINKY_PIXEL2-1.2 R124.2
N$126: ET_PINKY_PIXEL2-2.2 R125.2
N$127: ET_PINKY_PIXEL2-3.2 R126.2
N$128: ET_PINKY_PIXEL2-4.2 R127.2
N$129: ET_PINKY_PIXEL3-1.2 R128.2
N$130: ET_PINKY_PIXEL3-2.2 R129.2
N$131: ET_PINKY_PIXEL3-3.2 R130.2
N$132: ET_PINKY_PIXEL3-4.2 R131.2
N$133: ET_PINKY_PIXEL4-1.2 R132.2
N$134: ET_PINKY_PIXEL4-2.2 R133.2
N$135: ET_PINKY_PIXEL4-3.2 R134.2
N$136: ET_PINKY_PIXEL4-4.2 R135.2
N$137: L4.1 VREG3.5(VOUT)
N$138: OPAMP4.1(IN+) R136.1 R137.2
N$139: C76.1 OPAMP4.3(IN-) POT1.3(CW)
PINKY_IN1-1: ET_PINKY_PIXEL1-1.1 MUX_PINKY.22(PWM15)
PINKY_IN1-2: ET_PINKY_PIXEL1-2.1 MUX_PINKY.20(PWM13)
PINKY_IN1-3: ET_PINKY_PIXEL1-3.1 MUX_PINKY.18(PWM11)
PINKY_IN1-4: ET_PINKY_PIXEL1-4.1 MUX_PINKY.16(PWM9)
PINKY_IN2-1: ET_PINKY_PIXEL2-1.1 MUX_PINKY.21(PWM14)
PINKY_IN2-2: ET_PINKY_PIXEL2-2.1 MUX_PINKY.19(PWM12)
PINKY_IN2-3: ET_PINKY_PIXEL2-3.1 MUX_PINKY.17(PWM10)
PINKY_IN2-4: ET_PINKY_PIXEL2-4.1 MUX_PINKY.15(PWM8)
PINKY_IN3-1: ET_PINKY_PIXEL3-1.1 MUX_PINKY.13(PWM7)
PINKY_IN3-2: ET_PINKY_PIXEL3-2.1 MUX_PINKY.11(PWM5)
PINKY_IN3-3: ET_PINKY_PIXEL3-3.1 MUX_PINKY.9(PWM3)
PINKY_IN3-4: ET_PINKY_PIXEL3-4.1 MUX_PINKY.7(PWM1)
PINKY_IN4-1: ET_PINKY_PIXEL4-1.1 MUX_PINKY.12(PWM6)
PINKY_IN4-2: ET_PINKY_PIXEL4-2.1 MUX_PINKY.10(PWM4)
PINKY_IN4-3: ET_PINKY_PIXEL4-3.1 MUX_PINKY.8(PWM2)
PINKY_IN4-4: ET_PINKY_PIXEL4-4.1 MUX_PINKY.6(PWM0)
PINKY_OUT1-1 [DGND]: ET_PINKY_PIXEL1-1.3 PINKY_CONNECTOR.16
PINKY_OUT1-2 [DGND]: ET_PINKY_PIXEL1-2.3 PINKY_CONNECTOR.14
PINKY_OUT1-3 [DGND]: ET_PINKY_PIXEL1-3.3 PINKY_CONNECTOR.12
PINKY_OUT1-4 [DGND]: ET_PINKY_PIXEL1-4.3 PINKY_CONNECTOR.10
PINKY_OUT2-1 [DGND]: ET_PINKY_PIXEL2-1.3 PINKY_CONNECTOR.17
PINKY_OUT2-2 [DGND]: ET_PINKY_PIXEL2-2.3 PINKY_CONNECTOR.15
PINKY_OUT2-3 [DGND]: ET_PINKY_PIXEL2-3.3 PINKY_CONNECTOR.13
PINKY_OUT2-4 [DGND]: ET_PINKY_PIXEL2-4.3 PINKY_CONNECTOR.11
PINKY_OUT3-1 [DGND]: ET_PINKY_PIXEL3-1.3 PINKY_CONNECTOR.8
PINKY_OUT3-2 [DGND]: ET_PINKY_PIXEL3-2.3 PINKY_CONNECTOR.6
PINKY_OUT3-3 [DGND]: ET_PINKY_PIXEL3-3.3 PINKY_CONNECTOR.4
PINKY_OUT3-4 [DGND]: ET_PINKY_PIXEL3-4.3 PINKY_CONNECTOR.2
PINKY_OUT4-1 [DGND]: ET_PINKY_PIXEL4-1.3 PINKY_CONNECTOR.9
PINKY_OUT4-2 [DGND]: ET_PINKY_PIXEL4-2.3 PINKY_CONNECTOR.7
PINKY_OUT4-3 [DGND]: ET_PINKY_PIXEL4-3.3 PINKY_CONNECTOR.5
PINKY_OUT4-4 [DGND]: ET_PINKY_PIXEL4-4.3 PINKY_CONNECTOR.3
RING_IN1-1: ET_RING_PIXEL1-1.1 MUX_RING.7(PWM1)
RING_IN1-2: ET_RING_PIXEL1-2.1 MUX_RING.9(PWM3)
RING_IN1-3: ET_RING_PIXEL1-3.1 MUX_RING.11(PWM5)
RING_IN1-4: ET_RING_PIXEL1-4.1 MUX_RING.13(PWM7)
RING_IN2-1: ET_RING_PIXEL2-1.1 MUX_RING.6(PWM0)
RING_IN2-2: ET_RING_PIXEL2-2.1 MUX_RING.8(PWM2)
RING_IN2-3: ET_RING_PIXEL2-3.1 MUX_RING.10(PWM4)
RING_IN2-4: ET_RING_PIXEL2-4.1 MUX_RING.12(PWM6)
RING_IN3-1: ET_RING_PIXEL3-1.1 MUX_RING.16(PWM9)
RING_IN3-2: ET_RING_PIXEL3-2.1 MUX_RING.18(PWM11)
RING_IN3-3: ET_RING_PIXEL3-3.1 MUX_RING.20(PWM13)
RING_IN3-4: ET_RING_PIXEL3-4.1 MUX_RING.22(PWM15)
RING_IN4-1: ET_RING_PIXEL4-1.1 MUX_RING.15(PWM8)
RING_IN4-2: ET_RING_PIXEL4-2.1 MUX_RING.17(PWM10)
RING_IN4-3: ET_RING_PIXEL4-3.1 MUX_RING.19(PWM12)
RING_IN4-4: ET_RING_PIXEL4-4.1 MUX_RING.21(PWM14)
RING_OUT1-1 [DGND]: ET_RING_PIXEL1-1.3 RING_CONNECTOR.1
RING_OUT1-2 [DGND]: ET_RING_PIXEL1-2.3 RING_CONNECTOR.3
RING_OUT1-3 [DGND]: ET_RING_PIXEL1-3.3 RING_CONNECTOR.5
RING_OUT1-4 [DGND]: ET_RING_PIXEL1-4.3 RING_CONNECTOR.7
RING_OUT2-1 [DGND]: ET_RING_PIXEL2-1.3 RING_CONNECTOR.2
RING_OUT2-2 [DGND]: ET_RING_PIXEL2-2.3 RING_CONNECTOR.4
RING_OUT2-3 [DGND]: ET_RING_PIXEL2-3.3 RING_CONNECTOR.6
RING_OUT2-4 [DGND]: ET_RING_PIXEL2-4.3 RING_CONNECTOR.8
RING_OUT3-1 [DGND]: ET_RING_PIXEL3-1.3 RING_CONNECTOR.9
RING_OUT3-2 [DGND]: ET_RING_PIXEL3-2.3 RING_CONNECTOR.11
RING_OUT3-3 [DGND]: ET_RING_PIXEL3-3.3 RING_CONNECTOR.13
RING_OUT3-4 [DGND]: ET_RING_PIXEL3-4.3 RING_CONNECTOR.15
RING_OUT4-1 [DGND]: ET_RING_PIXEL4-1.3 RING_CONNECTOR.10
RING_OUT4-2 [DGND]: ET_RING_PIXEL4-2.3 RING_CONNECTOR.12
RING_OUT4-3 [DGND]: ET_RING_PIXEL4-3.3 RING_CONNECTOR.14
RING_OUT4-4 [DGND]: ET_RING_PIXEL4-4.3 RING_CONNECTOR.16
SCL: J7.2 MUX_INDEX.26(SCL) MUX_MIDDLE.26(SCL) MUX_PINKY.26(SCL) MUX_RING.26(SCL)
SDA: J7.1 MUX_INDEX.27(SDA) MUX_MIDDLE.27(SDA) MUX_PINKY.27(SDA) MUX_RING.27(SDA)
V+: ET_INDEX_PIXEL1-1.4 ET_INDEX_PIXEL1-2.4 ET_INDEX_PIXEL1-3.4 ET_INDEX_PIXEL1-4.4 ET_INDEX_PIXEL2-1.4 ET_INDEX_PIXEL2-2.4 ET_INDEX_PIXEL2-3.4 ET_INDEX_PIXEL2-4.4 ET_INDEX_PIXEL3-1.4 ET_INDEX_PIXEL3-2.4 ET_INDEX_PIXEL3-3.4 ET_INDEX_PIXEL3-4.4 ET_INDEX_PIXEL4-1.4 ET_INDEX_PIXEL4-2.4 ET_INDEX_PIXEL4-3.4 ET_INDEX_PIXEL4-4.4 ET_MIDDLE_PIXEL1-1.4 ET_MIDDLE_PIXEL1-2.4 ET_MIDDLE_PIXEL1-3.4 ET_MIDDLE_PIXEL1-4.4 ET_MIDDLE_PIXEL2-1.4 ET_MIDDLE_PIXEL2-2.4 ET_MIDDLE_PIXEL2-3.4 ET_MIDDLE_PIXEL2-4.4 ET_MIDDLE_PIXEL3-1.4 ET_MIDDLE_PIXEL3-2.4 ET_MIDDLE_PIXEL3-3.4 ET_MIDDLE_PIXEL3-4.4 ET_MIDDLE_PIXEL4-1.4 ET_MIDDLE_PIXEL4-2.4 ET_MIDDLE_PIXEL4-3.4 ET_MIDDLE_PIXEL4-4.4 ET_PINKY_PIXEL1-1.4 ET_PINKY_PIXEL1-2.4 ET_PINKY_PIXEL1-3.4 ET_PINKY_PIXEL1-4.4 ET_PINKY_PIXEL2-1.4 ET_PINKY_PIXEL2-2.4 ET_PINKY_PIXEL2-3.4 ET_PINKY_PIXEL2-4.4 ET_PINKY_PIXEL3-1.4 ET_PINKY_PIXEL3-2.4 ET_PINKY_PIXEL3-3.4 ET_PINKY_PIXEL3-4.4 ET_PINKY_PIXEL4-1.4 ET_PINKY_PIXEL4-2.4 ET_PINKY_PIXEL4-3.4 ET_PINKY_PIXEL4-4.4 ET_RING_PIXEL1-1.4 ET_RING_PIXEL1-2.4 ET_RING_PIXEL1-3.4 ET_RING_PIXEL1-4.4 ET_RING_PIXEL2-1.4 ET_RING_PIXEL2-2.4 ET_RING_PIXEL2-3.4 ET_RING_PIXEL2-4.4 ET_RING_PIXEL3-1.4 ET_RING_PIXEL3-2.4 ET_RING_PIXEL3-3.4 ET_RING_PIXEL3-4.4 ET_RING_PIXEL4-1.4 ET_RING_PIXEL4-2.4 ET_RING_PIXEL4-3.4 ET_RING_PIXEL4-4.4 IC1.13(OUT+)
V- [DGND]: IC1.14(OUT-) INDEX_CONNECTOR.17 MIDDLE_CONNECTOR.1 PINKY_CONNECTOR.1 RING_CONNECTOR.17
VBAT: C79.1 C80.1 J6.1 VREG-MCU1.3(VIN) VREG-MCU1.4(VIN)
Unconnected: J8.1 J8.2 J9.1 J9.2 SW1.1(S1) SW3.1(S1) SW4.1(S1) VREG-MCU1.7(FB/NC) VREG-MCU1.8(PG)

## Notes on the sheet
- TRANSMISSION OF TOUCH VR
- TOUCH GLOVE
- Rev 3
- Designed by: MrSwirlyEyes
- STAGE3
- STAGE1
- STAGE2
- +3.3V VREG | +1.8V VREG | -1.8V VREG | SQW GENERATOR | ANALOG VOLTAGE AMPLIFIER | ELECTROTACTILE ARRAYS
- ET ARRAY - INDEX
- 0x42
- ET ARRAY - MIDDLE
- 0x43
- ET ARRAY - RING
- 0x44
- ET ARRAY - PINKY
- 0x45

## Library data of the parts
C37 C49 C63 C64 C66 C68-C70 C76 C78 C80 = _capacitors:0.1UF; DATASHEET: https://product.tdk.com/info/en/catalog/datasheets/mlcc_commercial_soft_en.pdf; DIST: Digikey; DISTLINK: https://www.digikey.com/products/en?keywords=445-173610-1-ND; DISTPN: 445-173610-1-ND; MFR: TDK Corporation; MPN: C1005X7R1H104K050BE
C61 = _capacitors:0.1UF; DATASHEET: https://product.tdk.com/info/en/documents/chara_sheet/CGA3E3X8R1H104K080AB.pdf; DIST: Digikey; DISTLINK: https://www.digikey.com/products/en?keywords=445-12606-1-ND; DISTPN: 445-12606-1-ND; MFR: TDK Corporation; MPN: CGA3E3X8R1H104K080AB
C62 = _capacitors:0.1UF; DATASHEET: https://product.tdk.com/info/en/catalog/datasheets/mlcc_commercial_soft_en.pdf; DIST: Digikey; DISTLINK: https://www.digikey.com/products/en?keywords=445-6808-1-ND; DISTPN: 445-6808-1-ND; MFR: TDK Corporation; MPN: C2012X7T2E104M125AE
C65 = _capacitors:100UF-POLARIZED; DATASHEET: http://datasheets.avx.com/TLJ.pdf; DIST: Digikey; DISTLINK: https://www.digikey.com/products/en?keywords=478-5651-1-ND; DISTPN: 478-5651-1-ND; MFR: AVX Corporation; MPN: TLJA107M010R1400
C71-C73 C75 C77 C79 = _capacitors:10UF; DATASHEET: https://www.murata.com/~/media/webrenewal/support/library/catalog/products/capacitor/mlcc/c02e.ashx; DIST: Digikey; DISTLINK: https://www.digikey.com/products/en?keywords=490-13233-1-ND; DISTPN: 490-13233-1-ND; MFR: Murata Electronics North America; MPN: GRM155C80J106ME11D
C74 = _capacitors:4.7UF; DATASHEET: http://www.samsungsem.com/kr/support/product-search/mlcc/CL05A475MP5NRNC.jsp; DIST: Digikey; DISTLINK: https://www.digikey.com/products/en?keywords=1276-1482-1-ND; DISTPN: 1276-1482-1-ND; MFR: Samsung Electro-Mechanics; MPN: CL05A475MP5NRNC
ET_INDEX_PIXEL1-1-ET_INDEX_PIXEL1-4 ET_INDEX_PIXEL2-1-ET_INDEX_PIXEL2-4 ET_INDEX_PIXEL3-1-ET_INDEX_PIXEL3-4 ET_INDEX_PIXEL4-1-ET_INDEX_PIXEL4-4 ET_MIDDLE_PIXEL1-1-ET_MIDDLE_PIXEL1-4 ET_MIDDLE_PIXEL2-1-ET_MIDDLE_PIXEL2-4 ET_MIDDLE_PIXEL3-1-ET_MIDDLE_PIXEL3-4 ET_MIDDLE_PIXEL4-1-ET_MIDDLE_PIXEL4-4 ET_PINKY_PIXEL1-1-ET_PINKY_PIXEL1-4 ET_PINKY_PIXEL2-1-ET_PINKY_PIXEL2-4 ET_PINKY_PIXEL3-1-ET_PINKY_PIXEL3-4 ET_PINKY_PIXEL4-1-ET_PINKY_PIXEL4-4 ET_RING_PIXEL1-1-ET_RING_PIXEL1-4 ET_RING_PIXEL2-1-ET_RING_PIXEL2-4 ET_RING_PIXEL3-1-ET_RING_PIXEL3-4 ET_RING_PIXEL4-1-ET_RING_PIXEL4-4 = _relay:RELAY_SOLID-STATE; DATASHEET: http://www.ixysic.com/home/pdfs.nsf/www/CPC1010N.pdf/$file/CPC1010N.pdf; DIST: Digikey; DISTLINK: https://www.digikey.com/products/en?keywords=CPC1010N-ND; DISTPN: CPC1010N-ND; MFR: IXYS Integrated Circuits Division; MPN: CPC1010N
IC1 = _special:DRV8662_PIEZO_HAPTICS_DRIVER; DATASHEET: http://www.ti.com/lit/ds/symlink/drv8662.pdf; DIST: Digikey; DISTLINK: https://www.digikey.com/products/en?keywords=296-29164-1-ND; DISTPN: 296-29164-1-ND; MFR: Texas Instruments; MPN: DRV8662RGPR
INDEX_CONNECTOR MIDDLE_CONNECTOR PINKY_CONNECTOR RING_CONNECTOR = _connectors:1X17; DATASHEET: https://www.molex.com/pdm_docs/sd/532611771_sd.pdf; DATASHEET_CRIMP: https://www.molex.com/pdm_docs/sd/500798000_sd.pdf; DATASHEET_HOUSING: https://www.mouser.com/datasheet/2/276/0510211700_CRIMP_HOUSINGS-701987.pdf; DIST: Digikey; DISTLINK: https://www.digikey.com/products/en?keywords=WM10108CT-ND; DISTLINK_CRIMP: https://www.digikey.com/products/en?keywords=WM1142CT-ND; DISTLINK_HOUSING: https://www.mouser.com/ProductDetail/Molex/51021-1700?qs=%2Fha2pyFaduhTtHxds%252BiZNyfft3LkIIpppXLQlmBH7R4%3D; DISTPN: WM10108CT-ND; DISTPN_CRIMP: WM1142CT-ND; DISTPN_HOUSING: 538-51021-1700; DIST_CRIMP: Digikey; DIST_HOUSING: Mouser; MFR: Molex; MFR_CRIMP: Molex; MFR_HOUSING: Molex; MPN: 0532611771; MPN_CRIMP: 0500798000; MPN_HOUSING: 51021-1700
J6-J9 = _connectors:1X02: 2 Positions Header Connector 0.079" (2.00mm) Through Hole Tin; DATASHEET: https://drawings-pdf.s3.amazonaws.com/10492.pdf; DIST: Digikey; DISTLINK: https://www.digikey.com/products/en?keywords=PPTC021LFBN-RC; DISTPN: S7000-ND; MFR: Sullins Connector Solutions; MPN: PPTC021LFBN-RC
L3 = _inductors:4.7UH; DATASHEET: https://www.murata.com/~/media/webrenewal/products/inductor/chip/tokoproducts/wirewoundmetalalloychiptype/m_dfe252012p.ashx; DIST: Digkey; DISTLINK: https://www.digikey.com/products/en?keywords=490-10651-1-ND; DISTPN: 490-10651-1-ND; MFR: Murata Electronics North America; MPN: DFE252012P-4R7M=P2
L4 = _inductors:10UH; DATASHEET: http://ds.yuden.co.jp/TYCOMPAS/ut/detail.do?productNo=CBMF1608T100K&fileName=CBMF1608T100K_SS&mode=specSheetDownload; DIST: Digikey; DISTLINK: https://www.digikey.com/products/en?keywords=587-1720-1-ND; DISTPN: 587-1720-1-ND; MFR: Taiyo Yuden; MPN: Taiyo Yuden
MUX_INDEX MUX_MIDDLE MUX_PINKY MUX_RING = _special:PCA9685_16-CH_12-BIT_PWM-DRIVER; DATASHEET: https://www.nxp.com/docs/en/data-sheet/PCA9685.pdf; DIST: Digikey; DISTLINK: https://www.digikey.com/products/en?keywords=568-11925-1-ND; DISTPN: 568-11925-1-ND; MFR: NXP USA Inc.; MPN: PCA9685PW,118
NFET1 = _transistors:MOSFET_N-CHANNEL_2-ARRAY; DATASHEET: http://www.mccsemi.com/up_pdf/2N7002DW(SOT-363).PDF; DIST: Digikey; DISTLINK: https://www.digikey.com/products/en?keywords=2N7002DW-TPCT-ND; DISTPN: 2N7002DW-TPCT-ND; MFR: Micro Commercial Co; MPN: 2N7002DW-TP
OPAMP4 = _op_amps:TLV2361; DATASHEET: http://www.ti.com/lit/ds/symlink/tlv2361.pdf; DIST: Digikey; DISTLINK: https://www.digikey.com/products/en?keywords=296-13745-1-ND; DISTPN: 296-13745-1-ND; MFR: Texas Instruments; MPN: TLV2361IDBVR; VALUR: TLV2361
POT1 = _resistors:POTENTIOMETER; DATASHEET: https://www.nidec-copal-electronics.com/e/catalog/trimmer/st-4.pdf; DIST: Digikey; DISTLINK: https://www.digikey.com/products/en?keywords=ST4ETB104CT-ND; DISTPN: ST4ETB104CT-ND; MFR: Nidec Copal Electronics; MPN: ST4ETB104
R1 = _resistors:768KΩ; DATASHEET: http://www.yageo.com/documents/recent/PYu-RC_Group_51_RoHS_L_9.pdf; DIST: Digikey; DISTLINK: https://www.digikey.com/products/en?keywords=311-768KLRCT-ND; DISTPN: 311-768KLRCT-ND; MFR: Yageo; MPN: RC0402FR-07768KL
R2 = _resistors:35.7KΩ; DATASHEET: http://www.yageo.com/documents/recent/PYu-RC_Group_51_RoHS_L_9.pdf; DIST: Digikey; DISTLINK: https://www.digikey.com/products/en?keywords=311-35.7KLRCT-ND; DISTPN: 311-35.7KLRCT-ND; MFR: Yageo; MPN: RC0402FR-0735K7L; VALUE: 35.7K
R4 = _resistors:20KΩ; DATASHEET: http://www.yageo.com/documents/recent/PYu-RC_Group_51_RoHS_L_9.pdf; DIST: Digikey; DISTLINK: https://www.digikey.com/products/en?keywords=311-20.0KLRCT-ND; DISTPN: 311-20.0KLRCT-ND; MFR: Yageo; MPN: RC0402FR-0720KL; VALUE: 20K
R5 = _resistors:41.2KΩ; DATASHEET: http://www.yageo.com/documents/recent/PYu-RC_Group_51_RoHS_L_9.pdf; DIST: Digikey; DISTLINK: https://www.digikey.com/products/en?keywords=YAG3155CT-ND; DISTPN: YAG3155CT-ND; MFR: Yageo; MPN: RC0402FR-0741K2L; VALUE: 41.2K
R49 R57-R71 R88-R135 = _resistors:1KΩ; DATASHEET: http://www.yageo.com/documents/recent/PYu-RC_Group_51_RoHS_L_9.pdf; DIST: Digikey; DISTLINK: https://www.digikey.com/products/en?keywords=311-1.0KJRCT-ND; DISTPN: 311-1.0KJRCT-ND; MFR: Yageo; MPN: RC0402JR-071KL
R54-R56 R136 R137 = _resistors:10KΩ; DATASHEET: http://www.yageo.com/NewPortal/yageodocoutput?fileName=/pdf/R-Chip/PYu-RC_51_RoHS_P_0.pdf; DIST: Digikey; DISTLINK: https://www.digikey.com/products/en?keywords=YAG1281CT-ND; DISTPN: YAG1281CT-ND; MFR: Yageo; MPN: RC0402JR-0710KP
REXT = _resistors:7.5KΩ; DATASHEET: http://www.yageo.com/documents/recent/PYu-RC_Group_51_RoHS_L_9.pdf; DIST: Digikey; DISTLINK: https://www.digikey.com/products/en?keywords=311-7.50KLRCT-ND; DISTPN: 311-7.50KLRCT-ND; MFR: Yageo; MPN: RC0402FR-077K5L
SW1 SW3 SW4 = _switches:SWITCH_SPDT; CREATOR: MrSwirlyEyes; DATASHEET: https://media.digikey.com/pdf/Data%20Sheets/APEM%20Components%20PDFs/MA_Series_.pdf; DIST: Digikey; DISTLINK: https://www.digikey.com/products/en?keywords=679-1847-1-ND; DISTPN: 679-1847-1-ND; MFR: APEM Inc.; MPN: MA12RTR; TESTED: YES
VREG2 = _ic_power:VREG_NCP1729; DATASHEET: https://www.onsemi.com/pub/Collateral/NCP1729-D.PDF; DIST: Digikey; DISTLINK: https://www.digikey.com/products/en?keywords=NCV1729SN35T1GOSCT-ND; DISTPN: NCV1729SN35T1GOSCT-ND; MFR: ON Semiconductor; MPN: NCV1729SN35T1G
VREG3 = _ic_power:VREG_SWITCHING_TPS6220X; DATASHEET: http://www.ti.com/lit/ds/symlink/tps62200.pdf; DIST: Digikey; DISTLINK: https://www.digikey.com/products/en?keywords=296-16730-1-ND; DISTPN: 296-16730-1-ND; MFR: Texas Instruments; MPN: TPS62202DBVR
VREG-MCU1 = _ic_power:VREG_TPS768XX_ULDO_FAST-TRANSIENT; DATASHEET: http://www.ti.com/lit/ds/symlink/tps768.pdf; DIST: Digikey; DISTLINK: https://www.digikey.com/products/en?keywords=296-46395-1-ND; DISTPN: 296-46395-1-ND; MFR: Texas Instruments; MPN: TPS76833QDR

## Net classes
1 vcc: width 0.152 mm, drill 0.152 mm, clearance 0.152 mm
2 RFSIG: width 0.152 mm
3 ASIG: width 0.152 mm
4 DGND: width 0.152 mm
5 NGND: width 0.152 mm